# EAGLE schematic MM (EAGLE 9.2.1)
COMPANY: DvidMakesThings; REVISION: 0.0.1; WEB: https://github.com/DvidMakesThings

## Sheet 1 of 9: Microcontroller I.
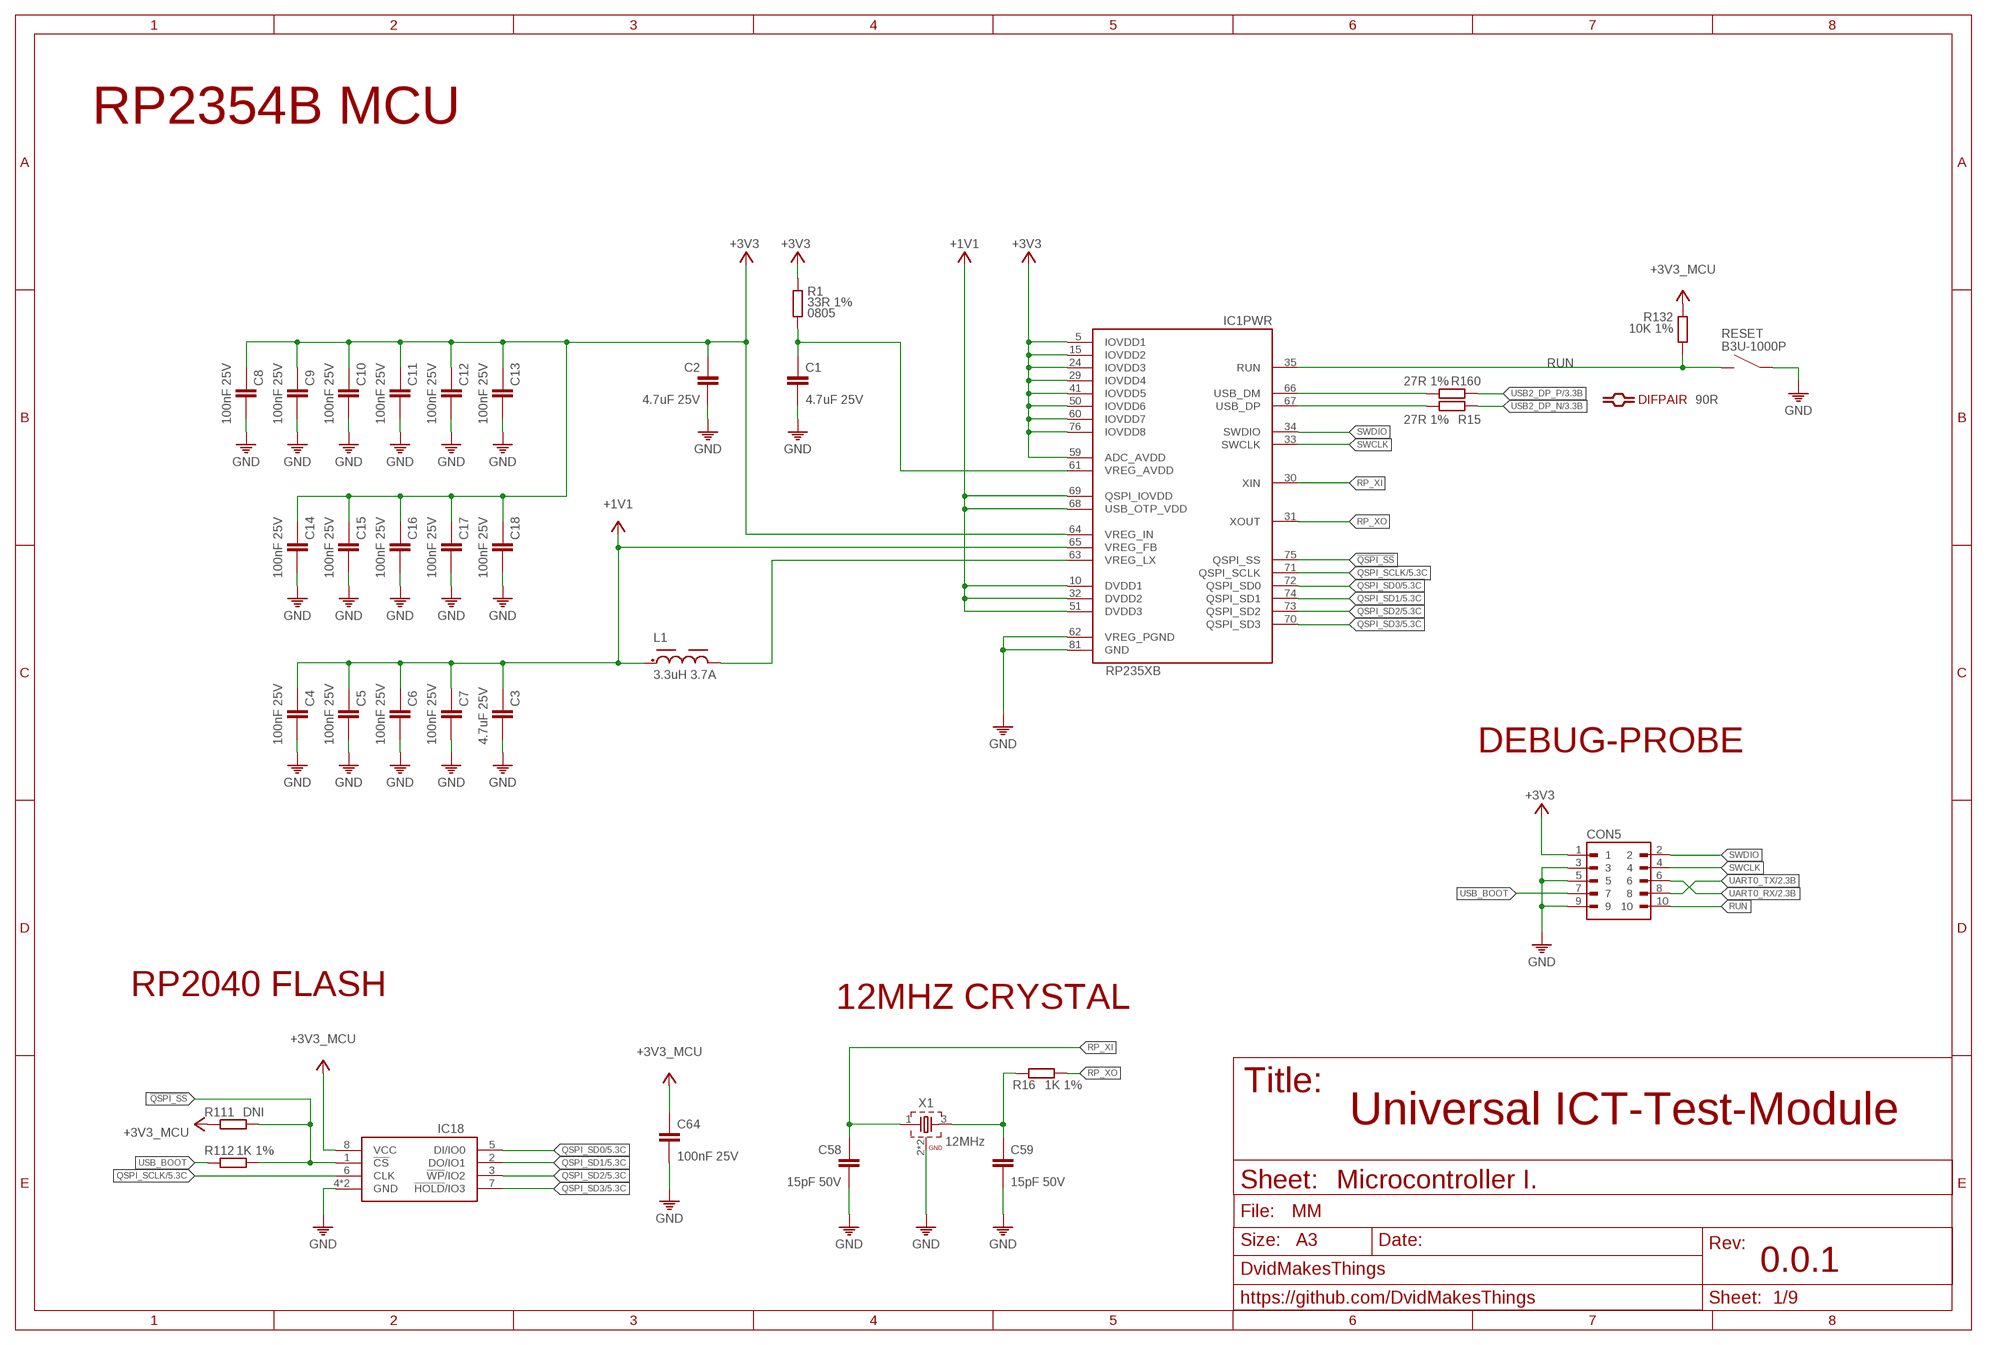
[diagram p0: schematic, sheet 1]

### Parts
C1  4.7uF 25V  4.7UF-25V0402  [0402@1]
C2  4.7uF 25V  4.7UF-25V0402  [0402@1]
C3  4.7uF 25V  4.7UF-25V0402  [0402@1]
C4  100nF 25V  100NF-25V-0201  [0201]
C5  100nF 25V  100NF-25V-0201  [0201]
C6  100nF 25V  100NF-25V-0201  [0201]
C7  100nF 25V  100NF-25V-0201  [0201]
C8  100nF 25V  100NF-25V-0201  [0201]
C9  100nF 25V  100NF-25V-0201  [0201]
C10  100nF 25V  100NF-25V-0201  [0201]
C11  100nF 25V  100NF-25V-0201  [0201]
C12  100nF 25V  100NF-25V-0201  [0201]
C13  100nF 25V  100NF-25V-0201  [0201]
C14  100nF 25V  100NF-25V-0201  [0201]
C15  100nF 25V  100NF-25V-0201  [0201]
C16  100nF 25V  100NF-25V-0201  [0201]
C17  100nF 25V  100NF-25V-0201  [0201]
C18  100nF 25V  100NF-25V-0201  [0201]
C58  15pF 50V  15PF-50V0201  [0201]
C59  15pF 50V  15PF-50V0201  [0201]
C64  100nF 25V  100NF-25V-0201  [0201]
CON5  3220_10_0300_00  [3220_10_0300_00]
IC1  RP235XB  [QFN80-10X10]
IC18  W25Q128JVPIQ  W25Q128JVP  [SON127P600X500X75-8N]
L1  3.3uH 3.7A  3.3UHL-6.6X6.6  [L-6.6X6.6]
R1  33R 1%  33R-1%0805  [0805]
R15  27R 1%  27R-1%0201  [0201]
R16  1K 1%  1K-1%0201  [0201]
R111  DNI  R0201  [R0201]
R112  1K 1%  1K-1%0402  [0402]
R132  10K 1%  10K-1%0402  [0402]
R160  27R 1%  27R-1%0201  [0201]
RESET  B3U-1000P  B3U-1000P  [B3U-1000P]
X1  12MHz  CRYSTAL-3225X322512MSB4SI  [WE-XTAL_CFPX-180]

### Nets
!QSPI_SS: IC1.75(PWR:QSPI_SS) IC18.1(!CS) R111.1 R112.2
+1V1: C3.1 C4.1 C5.1 C6.1 C7.1 IC1.10(PWR:DVDD1) IC1.32(PWR:DVDD2) IC1.51(PWR:DVDD3) IC1.65(PWR:VREG_FB) IC1.68(PWR:USB_OTP_VDD) IC1.69(PWR:QSPI_IOVDD) L1.1
+3V3: C2.1 C8.1 C9.1 C10.1 C11.1 C12.1 C13.1 C14.1 C15.1 C16.1 C17.1 C18.1 CON5.1 IC1.5(PWR:IOVDD1) IC1.15(PWR:IOVDD2) IC1.24(PWR:IOVDD3) IC1.29(PWR:IOVDD4) IC1.41(PWR:IOVDD5) IC1.50(PWR:IOVDD6) IC1.59(PWR:ADC_AVDD) IC1.60(PWR:IOVDD7) IC1.64(PWR:VREG_IN) IC1.76(PWR:IOVDD8) R1.1 ; also sheet 3,4,5,6
+3V3_MCU: C64.1 IC18.8(VCC) R111.2 R132.1
GND: C1.2 C2.2 C3.2 C4.2 C5.2 C6.2 C7.2 C8.2 C9.2 C10.2 C11.2 C12.2 C13.2 C14.2 C15.2 C16.2 C17.2 C18.2 C58.2 C59.2 C64.2 CON5.3 CON5.5 CON5.9 IC1.62(PWR:VREG_PGND) IC1.81(PWR:GND) IC18.4(GND) IC18.PAD(GND) RESET.1 X1.2(GND) X1.4(GND) ; also sheet 3,4,5,6
N$1: C1.1 IC1.61(PWR:VREG_AVDD) R1.2
N$2: IC1.63(PWR:VREG_LX) L1.2
N$53: C59.1 R16.1 X1.3
QSPI_SCLK: IC1.71(PWR:QSPI_SCLK) IC18.6(CLK) ; also sheet 5
QSPI_SD0: IC1.72(PWR:QSPI_SD0) IC18.5(DI/IO0) ; also sheet 5
QSPI_SD1: IC1.74(PWR:QSPI_SD1) IC18.2(DO/IO1) ; also sheet 5
QSPI_SD2: IC1.73(PWR:QSPI_SD2) IC18.3(!WP!/IO2) ; also sheet 5
QSPI_SD3: IC1.70(PWR:QSPI_SD3) IC18.7(!HOLD!/IO3) ; also sheet 5
RP_DP_N [90R_DIFFPAIR]: IC1.67(PWR:USB_DP) R15.2
RP_DP_P [90R_DIFFPAIR]: IC1.66(PWR:USB_DM) R160.2
RP_XI: C58.1 IC1.30(PWR:XIN) X1.1
RP_XO: IC1.31(PWR:XOUT) R16.2
RUN: CON5.10 IC1.35(PWR:RUN) R132.2 RESET.2
SWCLK: CON5.4 IC1.33(PWR:SWCLK)
SWDIO: CON5.2 IC1.34(PWR:SWDIO)
UART0_RX [90R_DIFFPAIR]: CON5.6 ; also sheet 2
UART0_TX [90R_DIFFPAIR]: CON5.8 ; also sheet 2
USB2_DP_N [90R_DIFFPAIR]: R15.1 ; also sheet 3
USB2_DP_P [90R_DIFFPAIR]: R160.1 ; also sheet 3
USB_BOOT: CON5.7 R112.1

### Notes on the sheet
- RP2354B MCU
- DEBUG-PROBE
- RP2040 FLASH
- 12MHZ CRYSTAL
- Universal ICT-Test-Module
- Microcontroller I.

## Sheet 2 of 9: Microcontroller II.
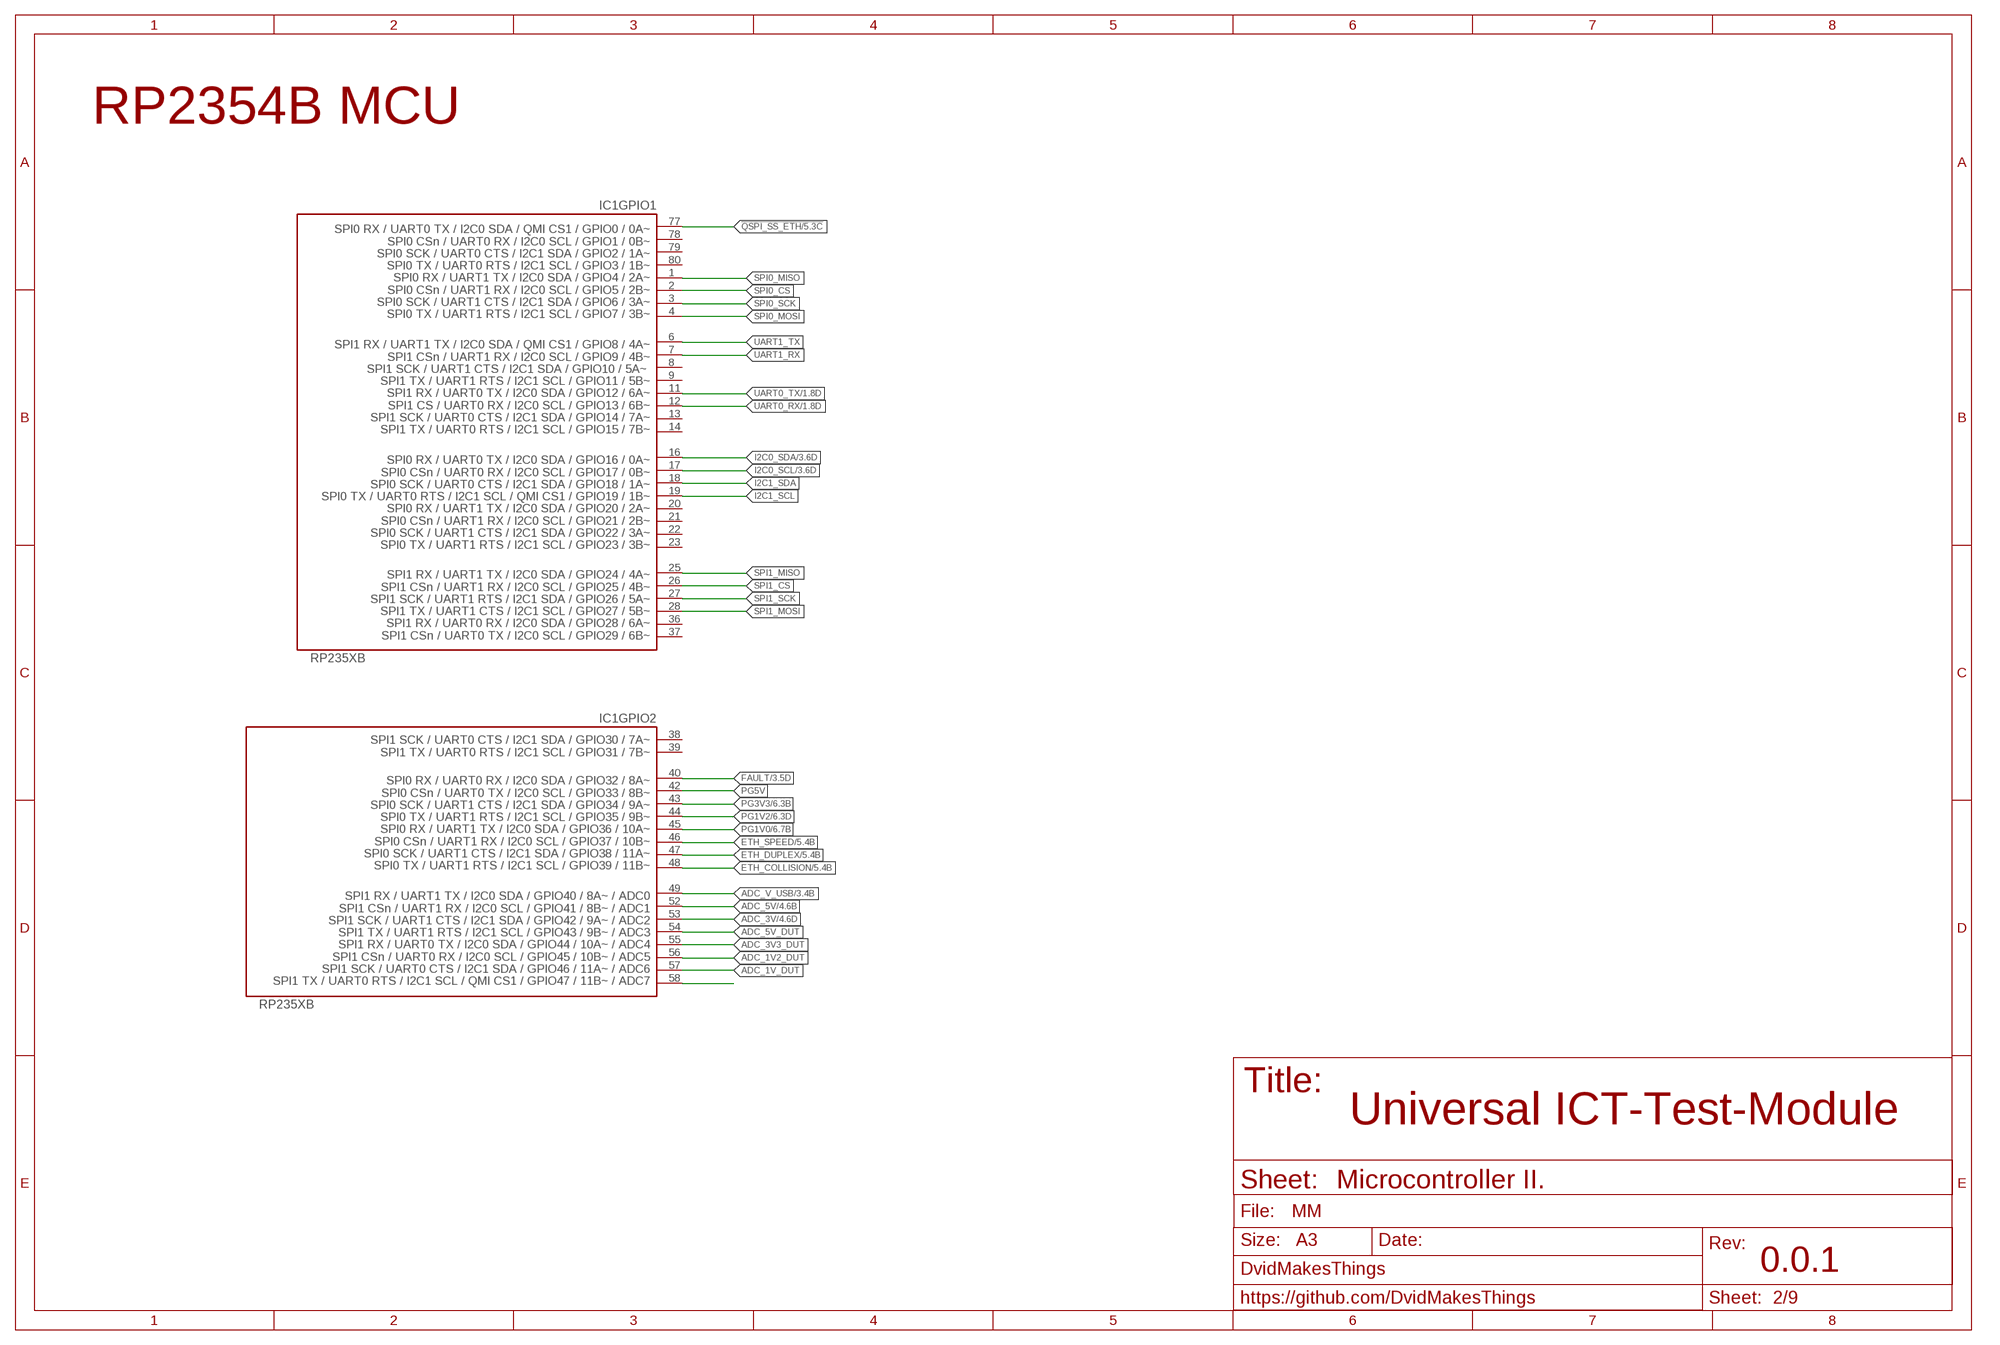
[diagram p1: schematic, sheet 2]

### Nets
!QSPI_SS_ETH: IC1.77(GPIO1:GPIO0) ; also sheet 5
ADC_1V2_DUT: IC1.56(GPIO2:GPIO45_ADC5)
ADC_1V_DUT: IC1.57(GPIO2:GPIO46_ADC6)
ADC_3V: IC1.53(GPIO2:GPIO42_ADC2) ; also sheet 4
ADC_3V3_DUT: IC1.55(GPIO2:GPIO44_ADC4)
ADC_5V: IC1.52(GPIO2:GPIO41_ADC1) ; also sheet 4
ADC_5V_DUT: IC1.54(GPIO2:GPIO43_ADC3)
ADC_V_USB: IC1.49(GPIO2:GPIO40_ADC0) ; also sheet 3
ETH_COLLISION [90R_DIFFPAIR]: IC1.48(GPIO2:GPIO39) ; also sheet 5
ETH_DUPLEX [90R_DIFFPAIR]: IC1.47(GPIO2:GPIO38) ; also sheet 5
ETH_SPEED [90R_DIFFPAIR]: IC1.46(GPIO2:GPIO37) ; also sheet 5
FAULT: IC1.40(GPIO2:GPIO32) ; also sheet 3
I2C0_SCL: IC1.17(GPIO1:GPIO17) ; also sheet 3
I2C0_SDA: IC1.16(GPIO1:GPIO16) ; also sheet 3
I2C1_SCL [90R_DIFFPAIR]: IC1.19(GPIO1:GPIO19)
I2C1_SDA [90R_DIFFPAIR]: IC1.18(GPIO1:GPIO18)
N$27: IC1.58(GPIO2:GPIO47_ADC7)
PG1V0: IC1.45(GPIO2:GPIO36) ; also sheet 6
PG1V2 [90R_DIFFPAIR]: IC1.44(GPIO2:GPIO35) ; also sheet 6
PG3V3: IC1.43(GPIO2:GPIO34) ; also sheet 6
PG5V: IC1.42(GPIO2:GPIO33)
SPI0_CS [90R_DIFFPAIR]: IC1.2(GPIO1:GPIO5)
SPI0_MISO [90R_DIFFPAIR]: IC1.1(GPIO1:GPIO4)
SPI0_MOSI [90R_DIFFPAIR]: IC1.4(GPIO1:GPIO7)
SPI0_SCK [90R_DIFFPAIR]: IC1.3(GPIO1:GPIO6)
SPI1_CS [90R_DIFFPAIR]: IC1.26(GPIO1:GPIO25)
SPI1_MISO [90R_DIFFPAIR]: IC1.25(GPIO1:GPIO24)
SPI1_MOSI [90R_DIFFPAIR]: IC1.28(GPIO1:GPIO27)
SPI1_SCK [90R_DIFFPAIR]: IC1.27(GPIO1:GPIO26)
UART0_RX [90R_DIFFPAIR]: IC1.12(GPIO1:GPIO13) ; also sheet 1
UART0_TX [90R_DIFFPAIR]: IC1.11(GPIO1:GPIO12) ; also sheet 1
UART1_RX [90R_DIFFPAIR]: IC1.7(GPIO1:GPIO9)
UART1_TX [90R_DIFFPAIR]: IC1.6(GPIO1:GPIO8)
Unconnected: IC1.8(GPIO1:GPIO10) IC1.9(GPIO1:GPIO11) IC1.13(GPIO1:GPIO14) IC1.14(GPIO1:GPIO15) IC1.20(GPIO1:GPIO20) IC1.21(GPIO1:GPIO21) IC1.22(GPIO1:GPIO22) IC1.23(GPIO1:GPIO23) IC1.36(GPIO1:GPIO28) IC1.37(GPIO1:GPIO29) IC1.38(GPIO2:GPIO30) IC1.39(GPIO2:GPIO31) IC1.78(GPIO1:GPIO1) IC1.79(GPIO1:GPIO2) IC1.80(GPIO1:GPIO3)

### Notes on the sheet
- RP2354B MCU
- Universal ICT-Test-Module
- Microcontroller II.

## Sheet 3 of 9: Power I. - USB
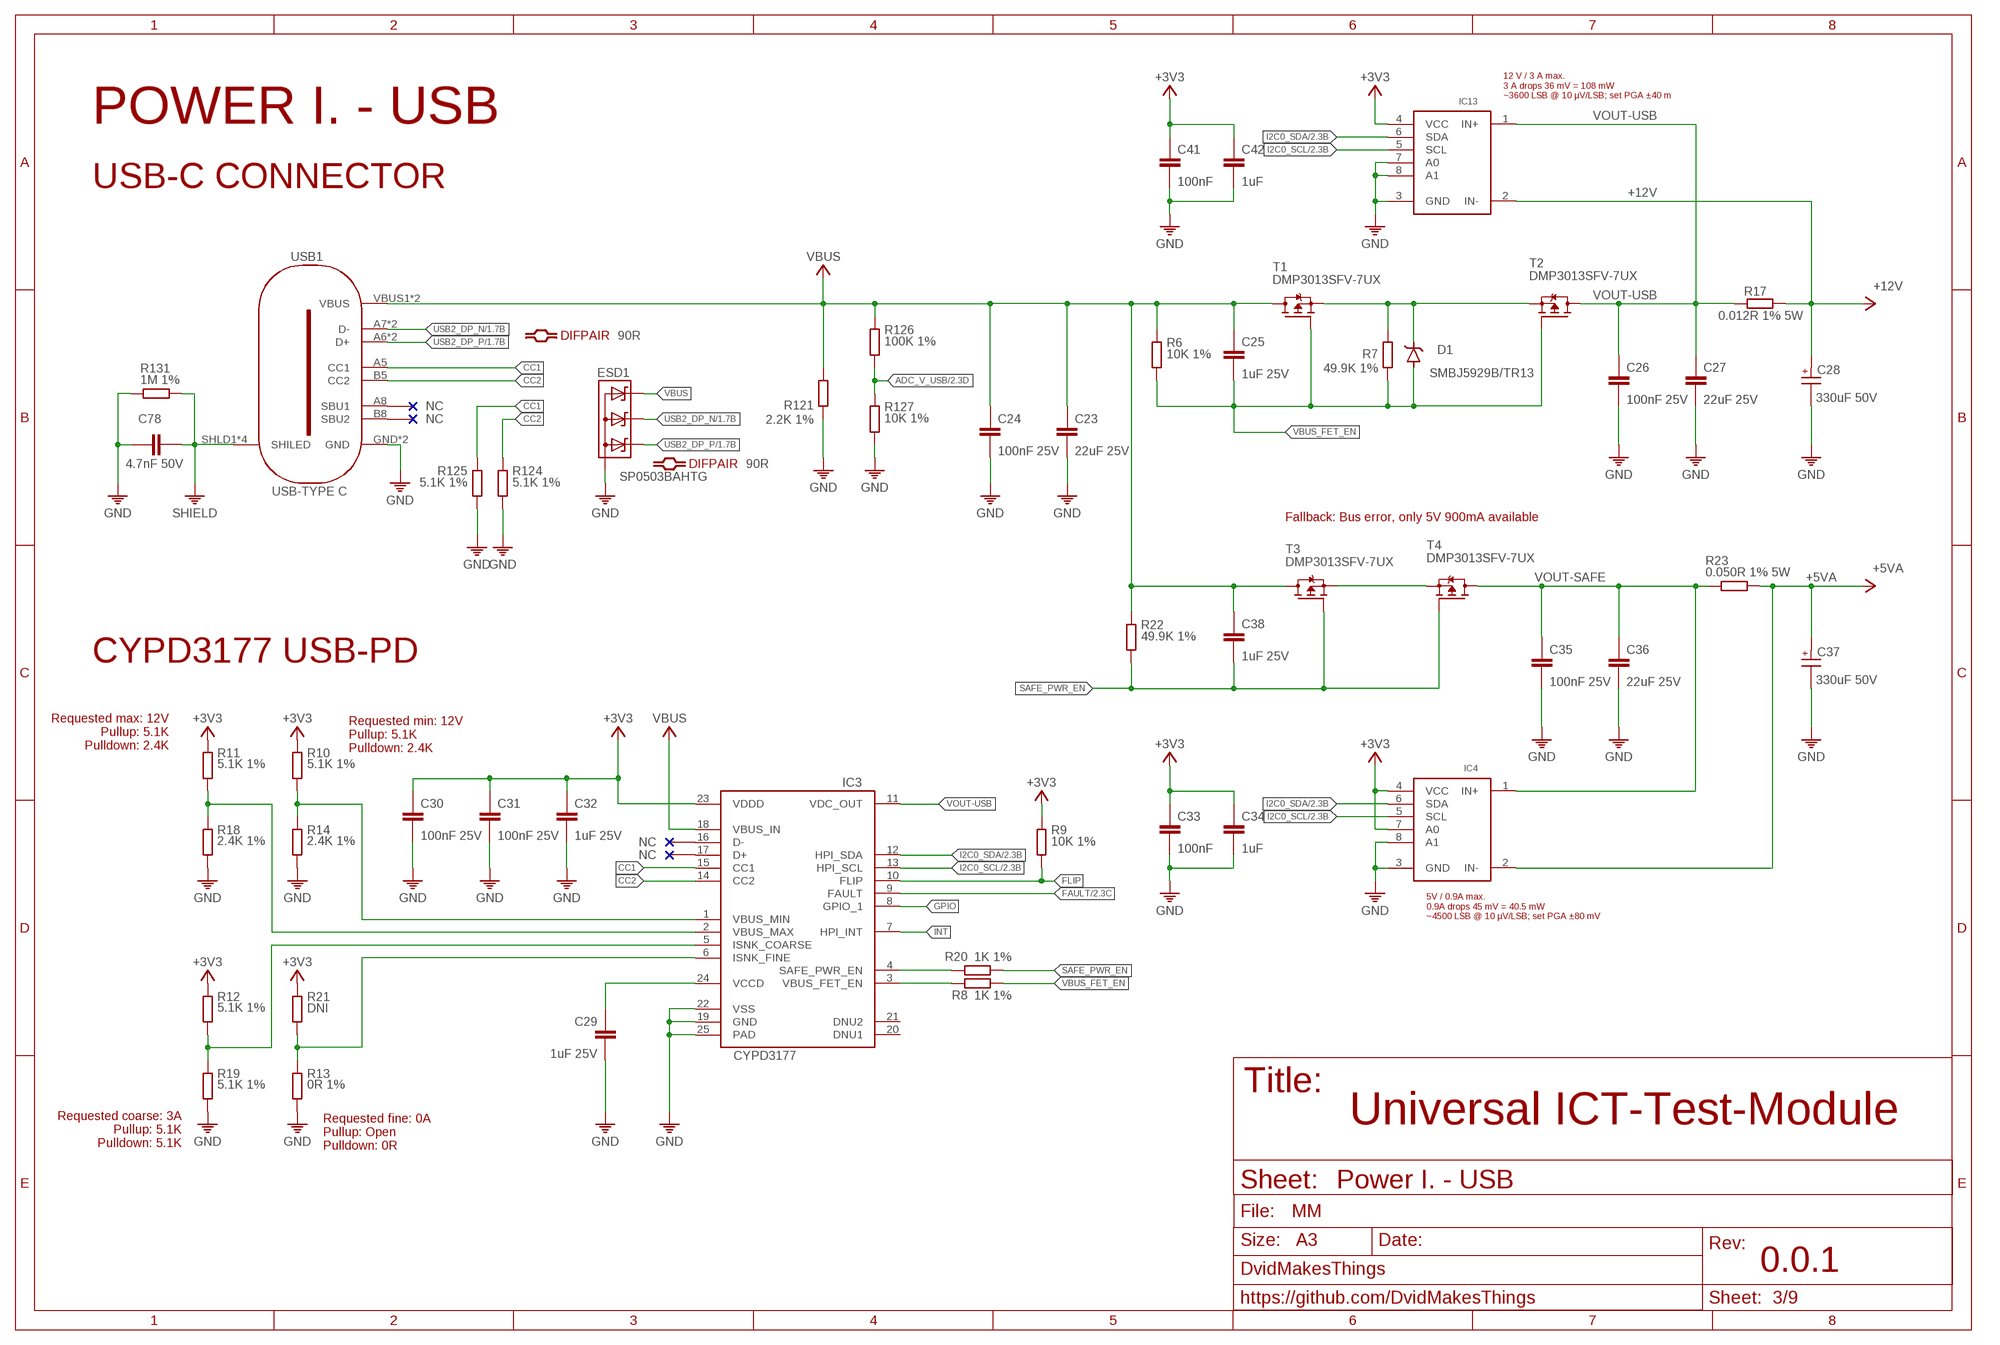
[diagram p2: schematic, sheet 3]

### Parts
C23  22uF 25V  22UF-25V-0805  [0805]
C24  100nF 25V  100NF-25V-0402  [0402]
C25  1uF 25V  1UF-25V0402  [0402@1]
C26  100nF 25V  100NF-25V-0402  [0402]
C27  22uF 25V  22UF-25V-0805  [0805]
C28  330uF 50V  330UF-50V10X10.5(DXL)  [10X10.5(DXL)]
C29  1uF 25V  1UF-25V0402  [0402@1]
C30  100nF 25V  100NF-25V-0402  [0402]
C31  100nF 25V  100NF-25V-0402  [0402]
C32  1uF 25V  1UF-25V0402  [0402@1]
C33  100nF  C-0201  [0201]
C34  1uF  C-0201  [0201]
C35  100nF 25V  100NF-25V-0402  [0402]
C36  22uF 25V  22UF-25V-0805  [0805]
C37  330uF 50V  330UF-50V10X10.5(DXL)  [10X10.5(DXL)]
C38  1uF 25V  1UF-25V0402  [0402@1]
C41  100nF  C-0201  [0201]
C42  1uF  C-0201  [0201]
C78  4.7nF 50V  4.7NF-50V0402  [0402@1]
D1  SMBJ5929B/TR13  SMBJ5929B  [WE-TVSP_DO-214AA_UNIDIRECTIONAL]
ESD1  SP0503BAHTG  SP0503BAHT  [SOT143]
IC3  CYPD3177  CYPD3177-24LQXQT  [QFN24]
IC4  INA219BIDCNT  [SOT23-8]
IC13  INA219BIDCNT  [SOT23-8]
R6  10K 1%  10K-1%0402  [0402]
R7  49.9K 1%  49.9K-1%0805  [0805]
R8  1K 1%  1K-1%0402  [0402]
R9  10K 1%  10K-1%0402  [0402]
R10  5.1K 1%  5.1K-1%0402  [0402]
R11  5.1K 1%  5.1K-1%0402  [0402]
R12  5.1K 1%  5.1K-1%0402  [0402]
R13  0R 1%  0R0402  [0402]
R14  2.4K 1%  2.4K-1%0402  [0402]
R17  0.012R 1% 5W  0.012R-1%  [2512]
R18  2.4K 1%  2.4K-1%0402  [0402]
R19  5.1K 1%  5.1K-1%0402  [0402]
R20  1K 1%  1K-1%0402  [0402]
R21  DNI  R0402  [0402]
R22  49.9K 1%  49.9K-1%0805  [0805]
R23  0.050R 1% 5W  0.050R-1%  [2512]
R121  2.2K 1%  2.2K-1%0201  [0201]
R124  5.1K 1%  5.1K-1%0201  [0201]
R125  5.1K 1%  5.1K-1%0201  [0201]
R126  100K 1%  100K-1%0402  [0402]
R127  10K 1%  10K-1%0201  [0201]
R131  1M 1%  1M-1%0402  [0402]
T1  DMP3013SFV-7UX  [POWERDI3333-8_UX_DIO-L]
T2  DMP3013SFV-7UX  [POWERDI3333-8_UX_DIO-L]
T3  DMP3013SFV-7UX  [POWERDI3333-8_UX_DIO-L]
T4  DMP3013SFV-7UX  [POWERDI3333-8_UX_DIO-L]
USB1  USB-TYPE-C-018  USB_C-THT  [USB-C]

### Nets
+3V3: C30.1 C31.1 C32.1 C33.1 C34.1 C41.1 C42.1 IC3.23(VDDD) IC4.4(VCC) IC4.7(A0) IC13.4(VCC) R9.1 R10.1 R11.1 R12.1 R21.1 ; also sheet 1,4,5,6
+5VA: C37.1(+) IC4.2(IN-) R23.2 ; also sheet 6
+12V: C28.1(+) IC13.2(IN-) R17.2 ; also sheet 4
ADC_V_USB: R126.2 R127.1 ; also sheet 2
CC1: IC3.15(CC1) R125.1 USB1.A5(CC1)
CC2: IC3.14(CC2) R124.1 USB1.B5(CC2)
FAULT: IC3.9(FAULT) ; also sheet 2
FLIP: IC3.10(FLIP) R9.2
GND: C23.2 C24.2 C26.2 C27.2 C28.2(-) C29.2 C30.2 C31.2 C32.2 C33.2 C34.2 C35.2 C36.2 C37.2(-) C41.2 C42.2 C78.2 ESD1.1(A) IC3.19(GND) IC3.22(VSS) IC3.25(PAD) IC4.3(GND) IC4.8(A1) IC13.3(GND) IC13.7(A0) IC13.8(A1) R13.2 R14.2 R18.2 R19.2 R121.2 R124.2 R125.2 R127.2 R131.2 USB1.GND USB1.GND2(GND) ; also sheet 1,4,5,6
GPIO: IC3.8(GPIO_1)
I2C0_SCL: IC3.13(HPI_SCL) IC4.5(SCL) IC13.5(SCL) ; also sheet 2
I2C0_SDA: IC3.12(HPI_SDA) IC4.6(SDA) IC13.6(SDA) ; also sheet 2
INT: IC3.7(HPI_INT)
N$3: D1.1(C) R7.1 T1.1(S) T1.2(S) T1.3(S) T2.1(S) T2.2(S) T2.3(S)
N$4: C29.1 IC3.24(VCCD)
N$8: IC3.3(VBUS_FET_EN) R8.2
N$9: IC3.1(VBUS_MIN) R10.2 R14.1
N$10: IC3.2(VBUS_MAX) R11.2 R18.1
N$11: IC3.6(ISNK_FINE) R13.1 R21.2
N$12: IC3.5(ISNK_COARSE) R12.2 R19.1
N$13: IC3.4(SAFE_PWR_EN) R20.2
N$14: T3.1(S) T3.2(S) T3.3(S) T4.1(S) T4.2(S) T4.3(S)
SAFE_PWR_EN: C38.2 R20.1 R22.2 T3.4(G) T4.4(G)
SHIELD: C78.1 R131.1 USB1.SHLD1(SHILED) USB1.SHLD2(SHILED) USB1.SHLD3(SHILED) USB1.SHLD4(SHILED)
USB2_DP_N [90R_DIFFPAIR]: ESD1.3(C2) USB1.A7(D-) USB1.B7(D-) ; also sheet 1
USB2_DP_P [90R_DIFFPAIR]: ESD1.2(C1) USB1.A6(D+) USB1.B6(D+) ; also sheet 1
VBUS: C23.1 C24.1 C25.1 C38.1 ESD1.4(C3) IC3.18(VBUS_IN) R6.1 R22.1 R121.1 R126.1 T1.5(D) T1.6(D) T1.7(D) T1.8(D) T1.9(D) T3.5(D) T3.6(D) T3.7(D) T3.8(D) T3.9(D) USB1.VBUS1(VBUS) USB1.VBUS2(VBUS)
VBUS_FET_EN: C25.2 D1.2(A) R6.2 R7.2 R8.1 T1.4(G) T2.4(G)
VOUT-SAFE: C35.1 C36.1 IC4.1(IN+) R23.1 T4.5(D) T4.6(D) T4.7(D) T4.8(D) T4.9(D)
VOUT-USB: C26.1 C27.1 IC3.11(VDC_OUT) IC13.1(IN+) R17.1 T2.5(D) T2.6(D) T2.7(D) T2.8(D) T2.9(D)
Unconnected: IC3.16(D-) IC3.17(D+) IC3.20(DNU1) IC3.21(DNU2) USB1.A8(SBU1) USB1.B8(SBU2)

### Notes on the sheet
- 12 V / 3 A max.
  3 A drops 36 mV = 108 mW
  ~3600 LSB @ 10 µV/LSB; set PGA ±40 m
- POWER I. - USB
- USB-C CONNECTOR
- Fallback: Bus error, only 5V 900mA available
- CYPD3177 USB-PD
- Requested max: 12V
  Pullup: 5.1K
  Pulldown: 2.4K
- Requested min: 12V
  Pullup: 5.1K
  Pulldown: 2.4K
- 5V / 0.9A max.
  0.9A drops 45 mV = 40.5 mW
  ~4500 LSB @ 10 µV/LSB; set PGA ±80 mV
- Requested coarse: 3A
  Pullup: 5.1K
  Pulldown: 5.1K
- Universal ICT-Test-Module
- Requested fine: 0A
  Pullup: Open
  Pulldown: 0R
- Power I. - USB

## Sheet 4 of 9: Power II. - LDO
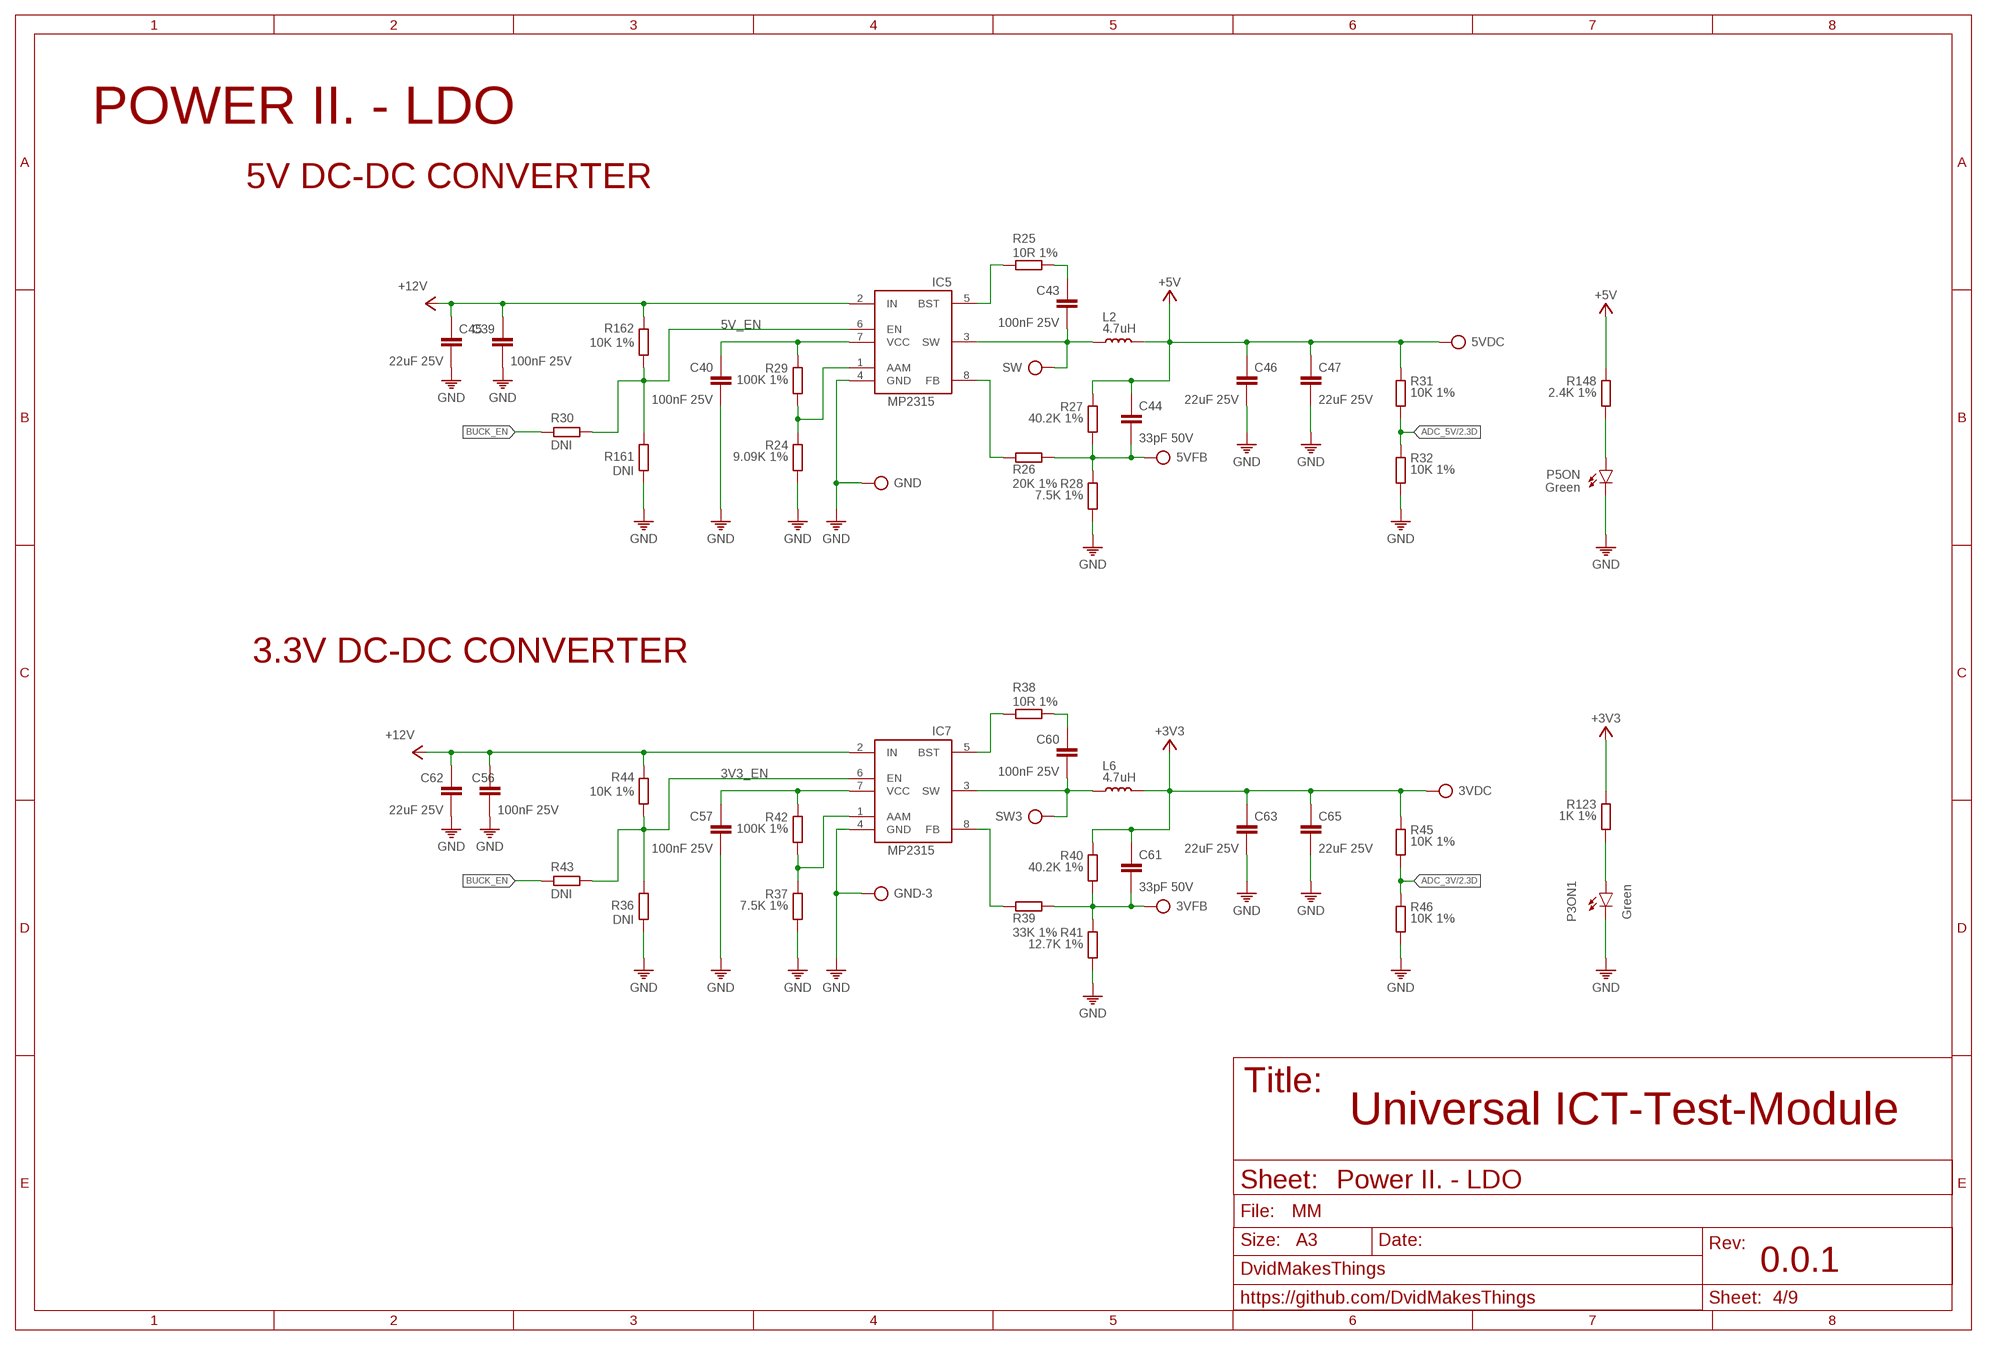
[diagram p3: schematic, sheet 4]

### Parts
3VDC  DNI  TP-ROUND  [TP-ROUND]
3VFB  DNI  TP-ROUND  [TP-ROUND]
5VDC  DNI  TP-ROUND  [TP-ROUND]
5VFB  DNI  TP-ROUND  [TP-ROUND]
C39  100nF 25V  100NF-25V-0402  [0402]
C40  100nF 25V  100NF-25V-0402  [0402]
C43  100nF 25V  100NF-25V-0402  [0402]
C44  33pF 50V  33PF-50V0402  [0402]
C45  22uF 25V  22UF-25V-1206  [1206]
C46  22uF 25V  22UF-25V-1206  [1206]
C47  22uF 25V  22UF-25V-1206  [1206]
C56  100nF 25V  100NF-25V-0402  [0402]
C57  100nF 25V  100NF-25V-0402  [0402]
C60  100nF 25V  100NF-25V-0402  [0402]
C61  33pF 50V  33PF-50V0402  [0402]
C62  22uF 25V  22UF-25V-1206  [1206]
C63  22uF 25V  22UF-25V-1206  [1206]
C65  22uF 25V  22UF-25V-1206  [1206]
GND  DNI  TP-ROUND  [TP-ROUND]
GND-3  DNI  TP-ROUND  [TP-ROUND]
IC5  MP2315GJ-Z  MP2315TSOT23-8  [SOT65P280X110-8N]
IC7  MP2315GJ-Z  MP2315TSOT23-8  [SOT65P280X110-8N]
L2  4.7uH  4.7UH  [SRR5228A]
L6  4.7uH  4.7UH  [SRR5228A]
P3ON1  Green  LED-GREENLED-0603  [LED-0603]
P5ON  Green  LED-GREENLED-0603  [LED-0603]
R24  9.09K 1%  9.09K-1%0402  [0402]
R25  10R 1%  10R-1%0402  [0402]
R26  20K 1%  20K-1%0402  [0402]
R27  40.2K 1%  40.2K-1%0402  [0402]
R28  7.5K 1%  7.5K-1%0402  [0402]
R29  100K 1%  100K-1%0402  [0402]
R30  DNI  R0402  [0402]
R31  10K 1%  10K-1%0201  [0201]
R32  10K 1%  10K-1%0201  [0201]
R36  DNI  R0402  [0402]
R37  7.5K 1%  7.5K-1%0402  [0402]
R38  10R 1%  10R-1%0402  [0402]
R39  33K 1%  33K-1%0402  [0402]
R40  40.2K 1%  40.2K-1%0402  [0402]
R41  12.7K 1%  12.7K-1%0402  [0402]
R42  100K 1%  100K-1%0402  [0402]
R43  DNI  R0402  [0402]
R44  10K 1%  10K-1%0402  [0402]
R45  10K 1%  10K-1%0201  [0201]
R46  10K 1%  10K-1%0201  [0201]
R123  1K 1%  1K-1%0402  [0402]
R148  2.4K 1%  2.4K-1%0402  [0402]
R161  DNI  R0402  [0402]
R162  10K 1%  10K-1%0402  [0402]
SW  DNI  TP-ROUND  [TP-ROUND]
SW3  DNI  TP-ROUND  [TP-ROUND]

### Nets
3V3_EN: IC7.6(EN) R36.2 R43.1 R44.1 ; also sheet 6
3VFB: 3VFB.TP C61.2 R39.2 R40.2 R41.1
5V_EN: IC5.6(EN) R30.1 R161.2 R162.1
5VFB: 5VFB.TP C44.2 R26.2 R27.2 R28.1
+3V3: 3VDC.TP C61.1 C63.1 C65.1 L6.2 R40.1 R45.1 R123.1 ; also sheet 1,3,5,6
+5V: 5VDC.TP C44.1 C46.1 C47.1 L2.2 R27.1 R31.1 R148.1 ; also sheet 6
+12V: C39.1 C45.1 C56.1 C62.1 IC5.2(IN) IC7.2(IN) R44.2 R162.2 ; also sheet 3
ADC_3V: R45.2 R46.1 ; also sheet 2
ADC_5V: R31.2 R32.1 ; also sheet 2
BUCK_EN: R30.2 R43.2
GND: C39.2 C40.2 C45.2 C46.2 C47.2 C56.2 C57.2 C62.2 C63.2 C65.2 GND-3.TP GND.TP IC5.4(GND) IC7.4(GND) P3ON1.C P5ON.C R24.2 R28.2 R32.2 R36.1 R37.2 R41.2 R46.2 R161.1 ; also sheet 1,3,5,6
N$15: IC5.5(BST) R25.2
N$16: IC5.8(FB) R26.1
N$17: P5ON.A R148.2
N$18: C43.1 R25.1
N$20: P3ON1.A R123.2
N$21: C40.1 IC5.7(VCC) R29.1
N$38: IC7.5(BST) R38.2
N$39: IC7.8(FB) R39.1
N$41: C60.1 R38.1
N$44: C57.1 IC7.7(VCC) R42.1
N$45: IC5.1(AAM) R24.1 R29.2
N$46: IC7.1(AAM) R37.1 R42.2
SW3: C60.2 IC7.3(SW) L6.1 SW3.TP
SW5: C43.2 IC5.3(SW) L2.1 SW.TP

### Notes on the sheet
- POWER II. - LDO
- 5V DC-DC CONVERTER
- 3.3V DC-DC CONVERTER
- Universal ICT-Test-Module
- Power II. - LDO

## Sheet 5 of 9: Ethernet
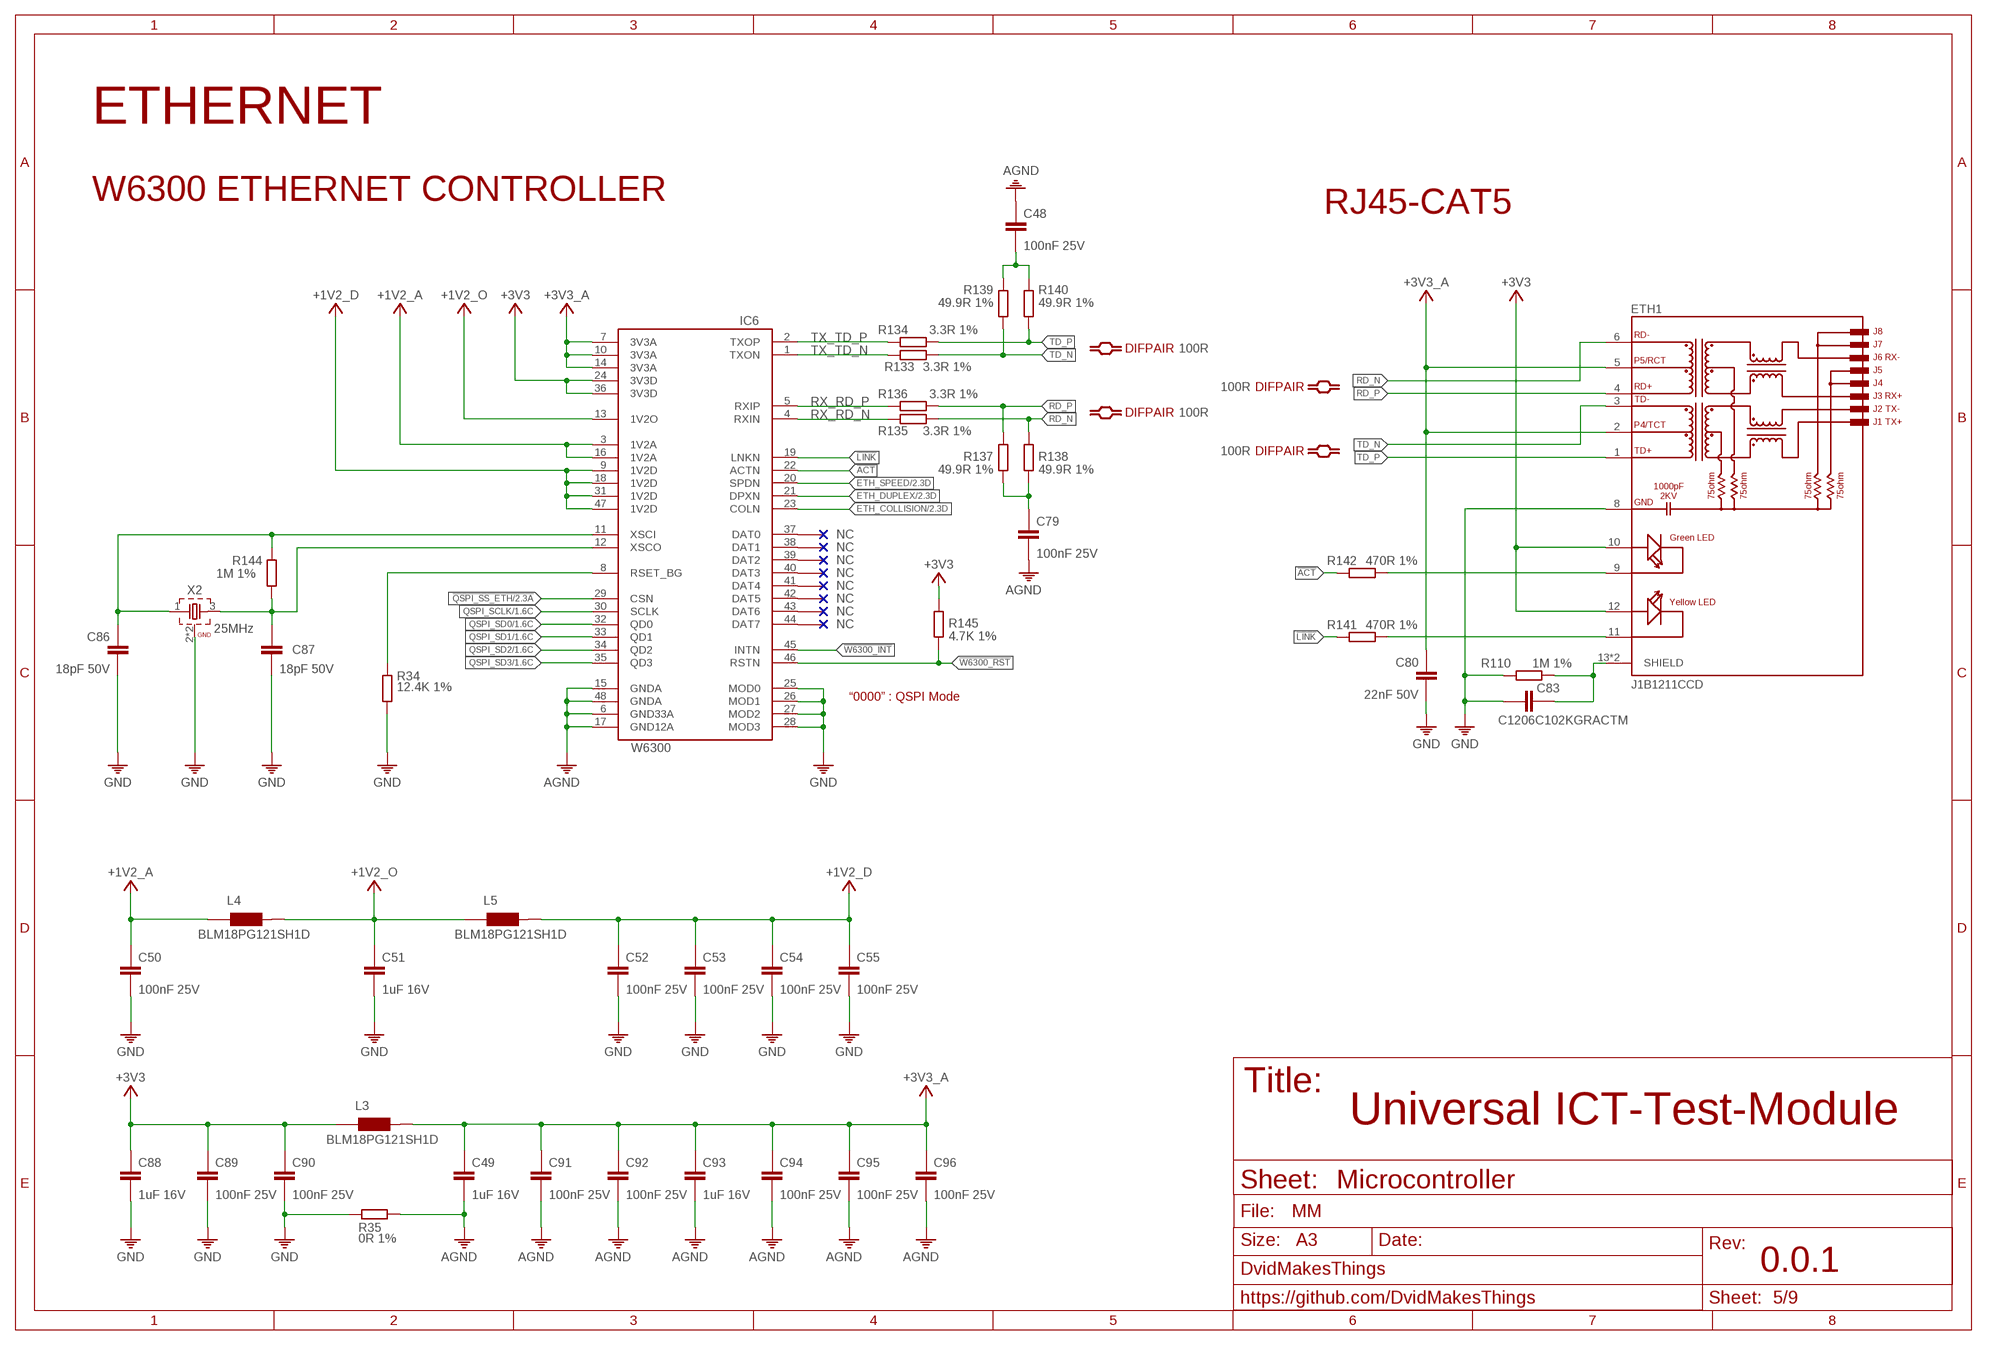
[diagram p4: schematic, sheet 5]

### Parts
C48  100nF 25V  100NF-25V-0402  [0402]
C49  1uF 16V  1UF-16V0201  [0201]
C50  100nF 25V  100NF-25V-0201  [0201]
C51  1uF 16V  1UF-16V0201  [0201]
C52  100nF 25V  100NF-25V-0201  [0201]
C53  100nF 25V  100NF-25V-0201  [0201]
C54  100nF 25V  100NF-25V-0201  [0201]
C55  100nF 25V  100NF-25V-0201  [0201]
C79  100nF 25V  100NF-25V-0402  [0402]
C80  22nF 50V  22NF-50V0402  [0402@1]
C83  C1206C102KGRACTM  1NF-2KV  [1206]
C86  18pF 50V  18PF-50V-0201  [0201]
C87  18pF 50V  18PF-50V-0201  [0201]
C88  1uF 16V  1UF-16V0201  [0201]
C89  100nF 25V  100NF-25V-0201  [0201]
C90  100nF 25V  100NF-25V-0201  [0201]
C91  100nF 25V  100NF-25V-0201  [0201]
C92  100nF 25V  100NF-25V-0201  [0201]
C93  1uF 16V  1UF-16V0201  [0201]
C94  100nF 25V  100NF-25V-0201  [0201]
C95  100nF 25V  100NF-25V-0201  [0201]
C96  100nF 25V  100NF-25V-0201  [0201]
ETH1  J1B1211CCD  [J1B1211CCD]
IC6  W6300  [LQFP48]
L3  BLM18PG121SH1D  [0603]
L4  BLM18PG121SH1D  [0603]
L5  BLM18PG121SH1D  [0603]
R34  12.4K 1%  12.4K-1%0402  [0402]
R35  0R 1%  0R0402  [0402]
R110  1M 1%  1M-1%1206  [1206]
R133  3.3R 1%  3.3R-1%0201  [0201]
R134  3.3R 1%  3.3R-1%0201  [0201]
R135  3.3R 1%  3.3R-1%0201  [0201]
R136  3.3R 1%  3.3R-1%0201  [0201]
R137  49.9R 1%  49.9R-1%0201  [0201]
R138  49.9R 1%  49.9R-1%0201  [0201]
R139  49.9R 1%  49.9R-1%0201  [0201]
R140  49.9R 1%  49.9R-1%0201  [0201]
R141  470R 1%  470R-1%0402  [0402]
R142  470R 1%  470R-1%0402  [0402]
R144  1M 1%  1M-1%0201  [0201]
R145  4.7K 1%  4.7K-1%0201  [0201]
X2  25MHz  CRYSTAL-3225X322525MOB4SI  [WE-XTAL_CFPX-180]

### Nets
!ACT: IC6.22(ACTN) R142.1
!LINK: IC6.19(LNKN) R141.1
!QSPI_SS_ETH: IC6.29(CSN) ; also sheet 2
!W6300_INT: IC6.45(INTN)
!W6300_RST: IC6.46(RSTN) R145.1
+1V2_A: C50.1 IC6.3(1V2A) IC6.16(1V2A) L4.1
+1V2_D: C52.1 C53.1 C54.1 C55.1 IC6.9(1V2D) IC6.18(1V2D) IC6.31(1V2D) IC6.47(1V2D) L5.2
+1V2_O: C51.1 IC6.13(1V2O) L4.2 L5.1
+3V3: C88.1 C89.1 C90.1 ETH1.10(GREEN+) ETH1.12(YELLOW+) IC6.24(3V3D) IC6.36(3V3D) L3.1 R145.2 ; also sheet 1,3,4,6
+3V3A: C49.1 C80.1 C91.1 C92.1 C93.1 C94.1 C95.1 C96.1 ETH1.2(P4/TCT) ETH1.5(P5/RCT) IC6.7(3V3A) IC6.10(3V3A) IC6.14(3V3A) L3.2 ; supply symbol labelled +3V3_A
AGND: C48.1 C49.2 C79.2 C91.2 C92.2 C93.2 C94.2 C95.2 C96.2 IC6.6(GND33A) IC6.15(GNDA) IC6.17(GND12A) IC6.48(GNDA) R35.1
ETH_COLLISION [90R_DIFFPAIR]: IC6.23(COLN) ; also sheet 2
ETH_DUPLEX [90R_DIFFPAIR]: IC6.21(DPXN) ; also sheet 2
ETH_SPEED [90R_DIFFPAIR]: IC6.20(SPDN) ; also sheet 2
GND: C50.2 C51.2 C52.2 C53.2 C54.2 C55.2 C80.2 C83.1 C86.2 C87.2 C88.2 C89.2 C90.2 ETH1.8(GND) IC6.25(MOD0) IC6.26(MOD1) IC6.27(MOD2) IC6.28(MOD3) R34.2 R35.2 R110.1 X2.2(GND) X2.4(GND) ; also sheet 1,3,4,6
N$35: IC6.8(RSET_BG) R34.1
N$82: ETH1.11(YELLOW-) R141.2
N$91: ETH1.9(GREEN-) R142.2
N$101: C87.1 IC6.12(XSCO) R144.1 X2.3
QSPI_SCLK: IC6.30(SCLK) ; also sheet 1
QSPI_SD0: IC6.32(QD0) ; also sheet 1
QSPI_SD1: IC6.33(QD1) ; also sheet 1
QSPI_SD2: IC6.34(QD2) ; also sheet 1
QSPI_SD3: IC6.35(QD3) ; also sheet 1
RD_N [100R_DIFFPAIR]: ETH1.6(RD-) R135.2 R138.2
RD_P [100R_DIFFPAIR]: ETH1.4(RD+) R136.2 R137.2
RX_CM: C79.1 R137.1 R138.1
RX_RD_N [100R_DIFFPAIR]: IC6.4(RXIN) R135.1
RX_RD_P [100R_DIFFPAIR]: IC6.5(RXIP) R136.1
SH1: C83.2 ETH1.13(SHIELD) ETH1.14(SHIELD) R110.2
TD_N [100R_DIFFPAIR]: ETH1.3(TD-) R133.2 R139.1
TD_P [100R_DIFFPAIR]: ETH1.1(TD+) R134.2 R140.1
TX_CM: C48.2 R139.2 R140.2
TX_TD_N [100R_DIFFPAIR]: IC6.1(TXON) R133.1
TX_TD_P [100R_DIFFPAIR]: IC6.2(TXOP) R134.1
XO: C86.1 IC6.11(XSCI) R144.2 X2.1
Unconnected: IC6.37(DAT0) IC6.38(DAT1) IC6.39(DAT2) IC6.40(DAT3) IC6.41(DAT4) IC6.42(DAT5) IC6.43(DAT6) IC6.44(DAT7)

### Notes on the sheet
- ETHERNET
- W6300 ETHERNET CONTROLLER
- RJ45-CAT5
- “0000” : QSPI Mode
- Universal ICT-Test-Module
- Microcontroller

## Sheet 6 of 9: DUT-Power
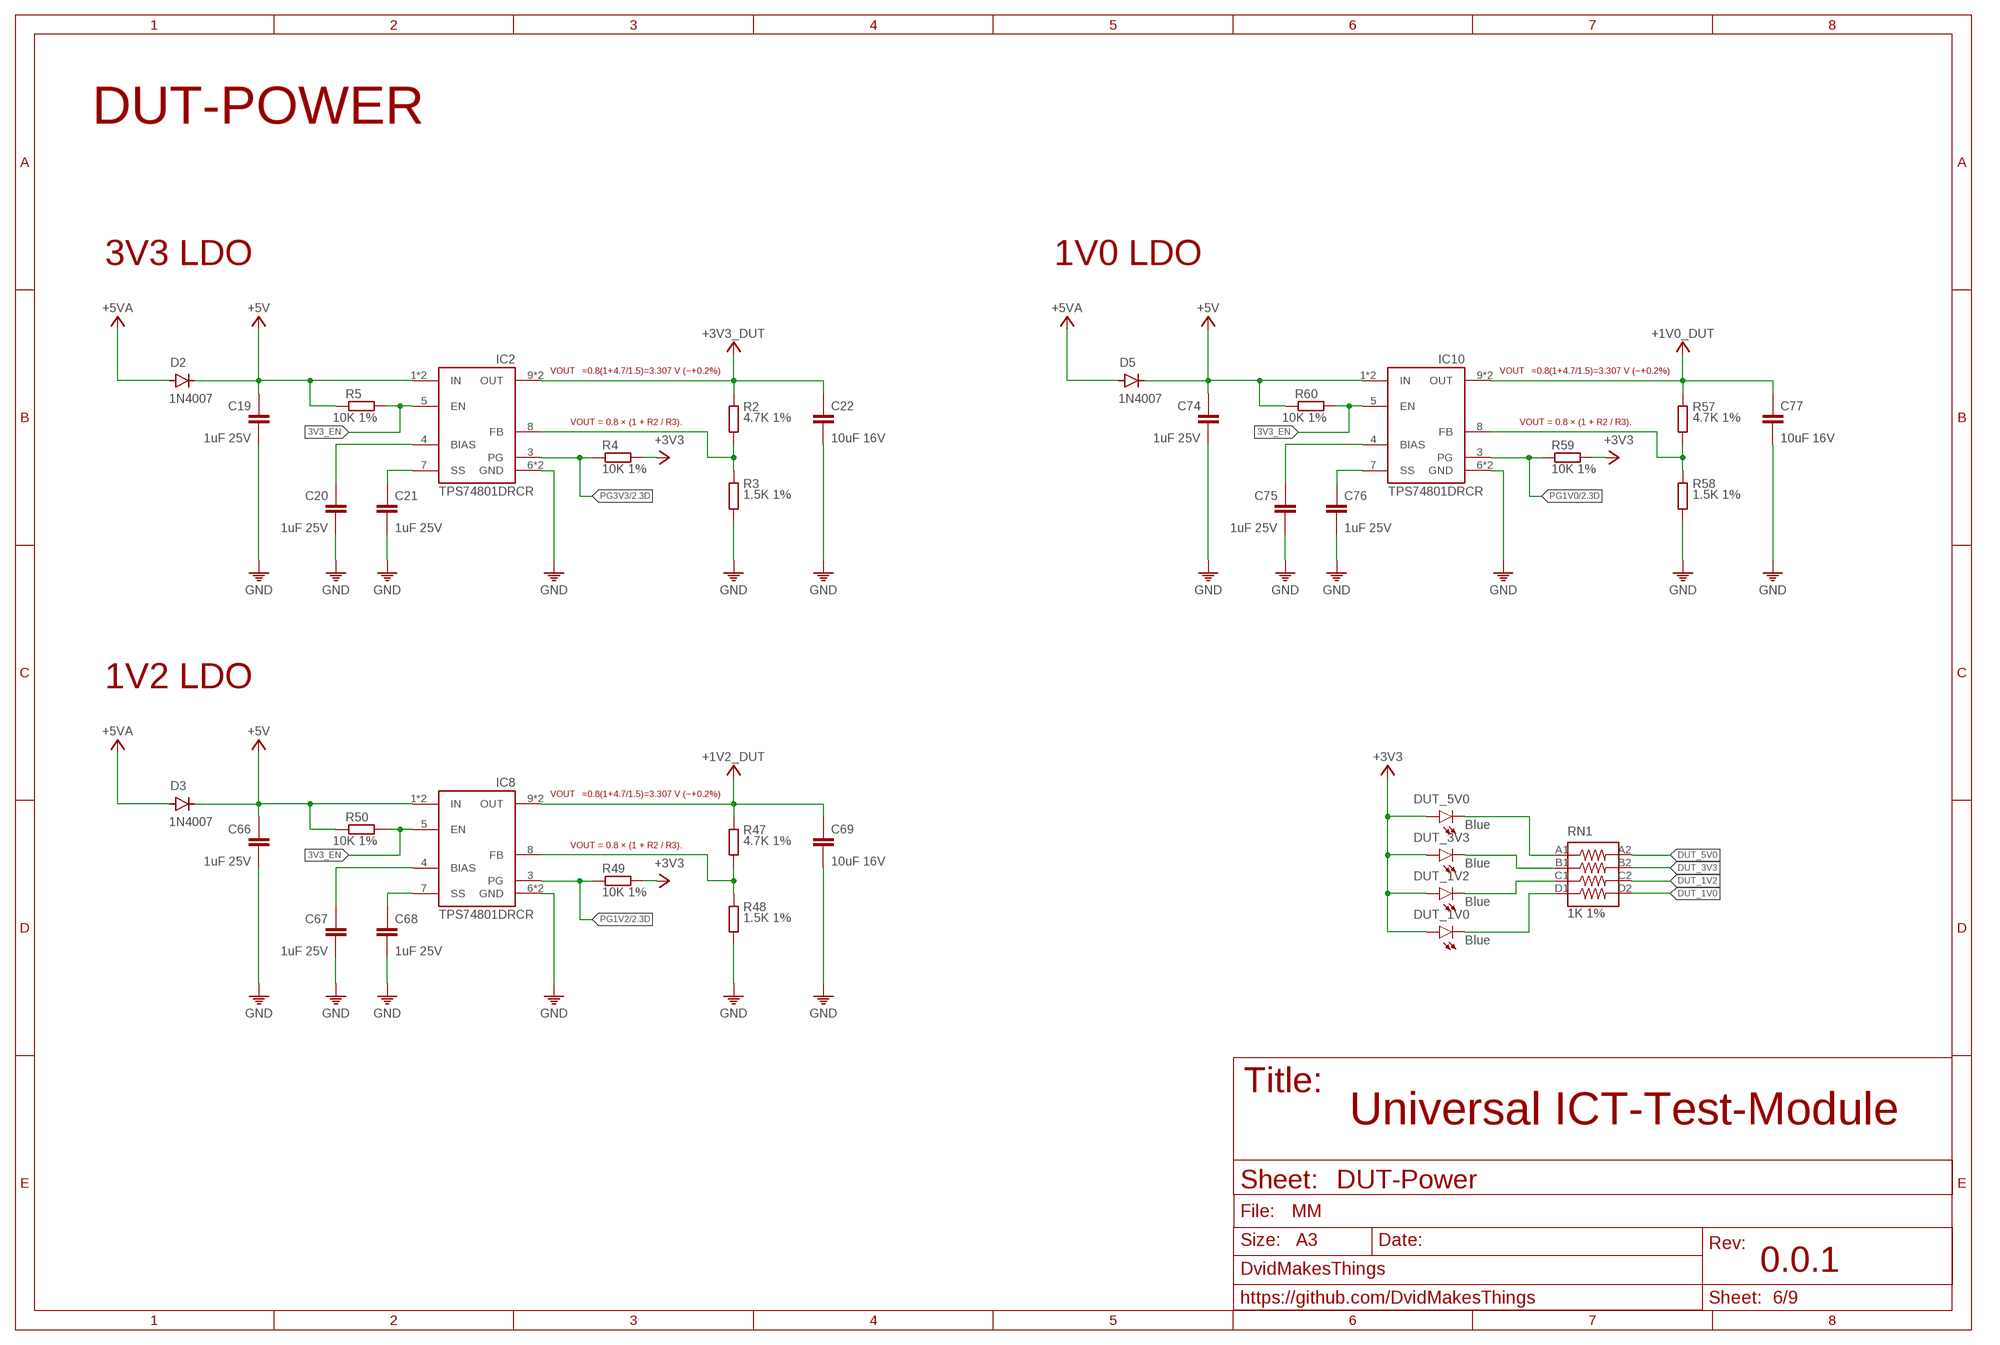
[diagram p5: schematic, sheet 6]

### Parts
C19  1uF 25V  1UF-25V0402  [0402@1]
C20  1uF 25V  1UF-25V0402  [0402@1]
C21  1uF 25V  1UF-25V0402  [0402@1]
C22  10uF 16V  10UF-16V-0603  [0603]
C66  1uF 25V  1UF-25V0402  [0402@1]
C67  1uF 25V  1UF-25V0402  [0402@1]
C68  1uF 25V  1UF-25V0402  [0402@1]
C69  10uF 16V  10UF-16V-0603  [0603]
C74  1uF 25V  1UF-25V0402  [0402@1]
C75  1uF 25V  1UF-25V0402  [0402@1]
C76  1uF 25V  1UF-25V0402  [0402@1]
C77  10uF 16V  10UF-16V-0603  [0603]
D2  1N4007  [SMA/DO-214AC]
D3  1N4007  [SMA/DO-214AC]
D5  1N4007  [SMA/DO-214AC]
DUT_1V0  Blue  LED-BLUELED-0603  [LED-0603]
DUT_1V2  Blue  LED-BLUELED-0603  [LED-0603]
DUT_3V3  Blue  LED-BLUELED-0603  [LED-0603]
DUT_5V0  Blue  LED-BLUELED-0603  [LED-0603]
IC2  TPS74801DRCR  TPS74801DRC  [VSON10-3X3]
IC8  TPS74801DRCR  TPS74801DRC  [VSON10-3X3]
IC10  TPS74801DRCR  TPS74801DRC  [VSON10-3X3]
R2  4.7K 1%  4.7K-1%0402  [0402]
R3  1.5K 1%  1.5K-1%0402  [0402]
R4  10K 1%  10K-1%0402  [0402]
R5  10K 1%  10K-1%0402  [0402]
R47  4.7K 1%  4.7K-1%0402  [0402]
R48  1.5K 1%  1.5K-1%0402  [0402]
R49  10K 1%  10K-1%0402  [0402]
R50  10K 1%  10K-1%0402  [0402]
R57  4.7K 1%  4.7K-1%0402  [0402]
R58  1.5K 1%  1.5K-1%0402  [0402]
R59  10K 1%  10K-1%0402  [0402]
R60  10K 1%  10K-1%0402  [0402]
RN1  1K 1%  1K-1%_ARRAY0603X4-1206  [_0603X4-1206]

### Nets
3V3_EN: IC2.5(EN) IC8.5(EN) IC10.5(EN) R5.2 R50.2 R60.2 ; also sheet 4
+1V0_DUT: C77.1 IC10.9(OUT) IC10.10(OUT) R57.1
+1V2_DUT: C69.1 IC8.9(OUT) IC8.10(OUT) R47.1
+3V3: DUT_1V0.A DUT_1V2.A DUT_3V3.A DUT_5V0.A R4.1 R49.1 R59.1 ; also sheet 1,3,4,5
+3V3_DUT: C22.1 IC2.9(OUT) IC2.10(OUT) R2.1
+5V: C19.1 C66.1 C74.1 D2.C D3.C D5.C IC2.1(IN) IC2.2(IN) IC8.1(IN) IC8.2(IN) IC10.1(IN) IC10.2(IN) R5.1 R50.1 R60.1 ; also sheet 4
+5VA: D2.A D3.A D5.A ; also sheet 3
DUT_1V0 [90R_DIFFPAIR]: RN1.D2
DUT_1V2 [90R_DIFFPAIR]: RN1.C2
DUT_3V3 [90R_DIFFPAIR]: RN1.B2
DUT_5V0 [90R_DIFFPAIR]: RN1.A2
GND: C19.2 C20.2 C21.2 C22.2 C66.2 C67.2 C68.2 C69.2 C74.2 C75.2 C76.2 C77.2 IC2.6(GND) IC2.PAD(GND) IC8.6(GND) IC8.PAD(GND) IC10.6(GND) IC10.PAD(GND) R3.2 R48.2 R58.2 ; also sheet 1,3,4,5
N$5: C20.1 IC2.4(BIAS)
N$6: C21.1 IC2.7(SS)
N$7: IC2.8(FB) R2.2 R3.1
N$19 [90R_DIFFPAIR]: DUT_5V0.C RN1.A1
N$22: C67.1 IC8.4(BIAS)
N$23: C68.1 IC8.7(SS)
N$24: IC8.8(FB) R47.2 R48.1
N$25 [90R_DIFFPAIR]: DUT_3V3.C RN1.B1
N$30 [90R_DIFFPAIR]: DUT_1V2.C RN1.C1
N$31: C75.1 IC10.4(BIAS)
N$32: C76.1 IC10.7(SS)
N$33: IC10.8(FB) R57.2 R58.1
N$34 [90R_DIFFPAIR]: DUT_1V0.C RN1.D1
PG1V0: IC10.3(PG) R59.2 ; also sheet 2
PG1V2 [90R_DIFFPAIR]: IC8.3(PG) R49.2 ; also sheet 2
PG3V3: IC2.3(PG) R4.2 ; also sheet 2

### Notes on the sheet
- DUT-POWER
- 3V3 LDO | 1V0 LDO
- VOUT​≈0.8(1+4.7/1.5)=3.307 V (~+0.2%) | VOUT​≈0.8(1+4.7/1.5)=3.307 V (~+0.2%)
- VOUT = 0.8 × (1 + R2 / R3). | VOUT = 0.8 × (1 + R2 / R3).
- 1V2 LDO
- VOUT​≈0.8(1+4.7/1.5)=3.307 V (~+0.2%)
- VOUT = 0.8 × (1 + R2 / R3).
- Universal ICT-Test-Module
- DUT-Power

## Sheet 7 of 9
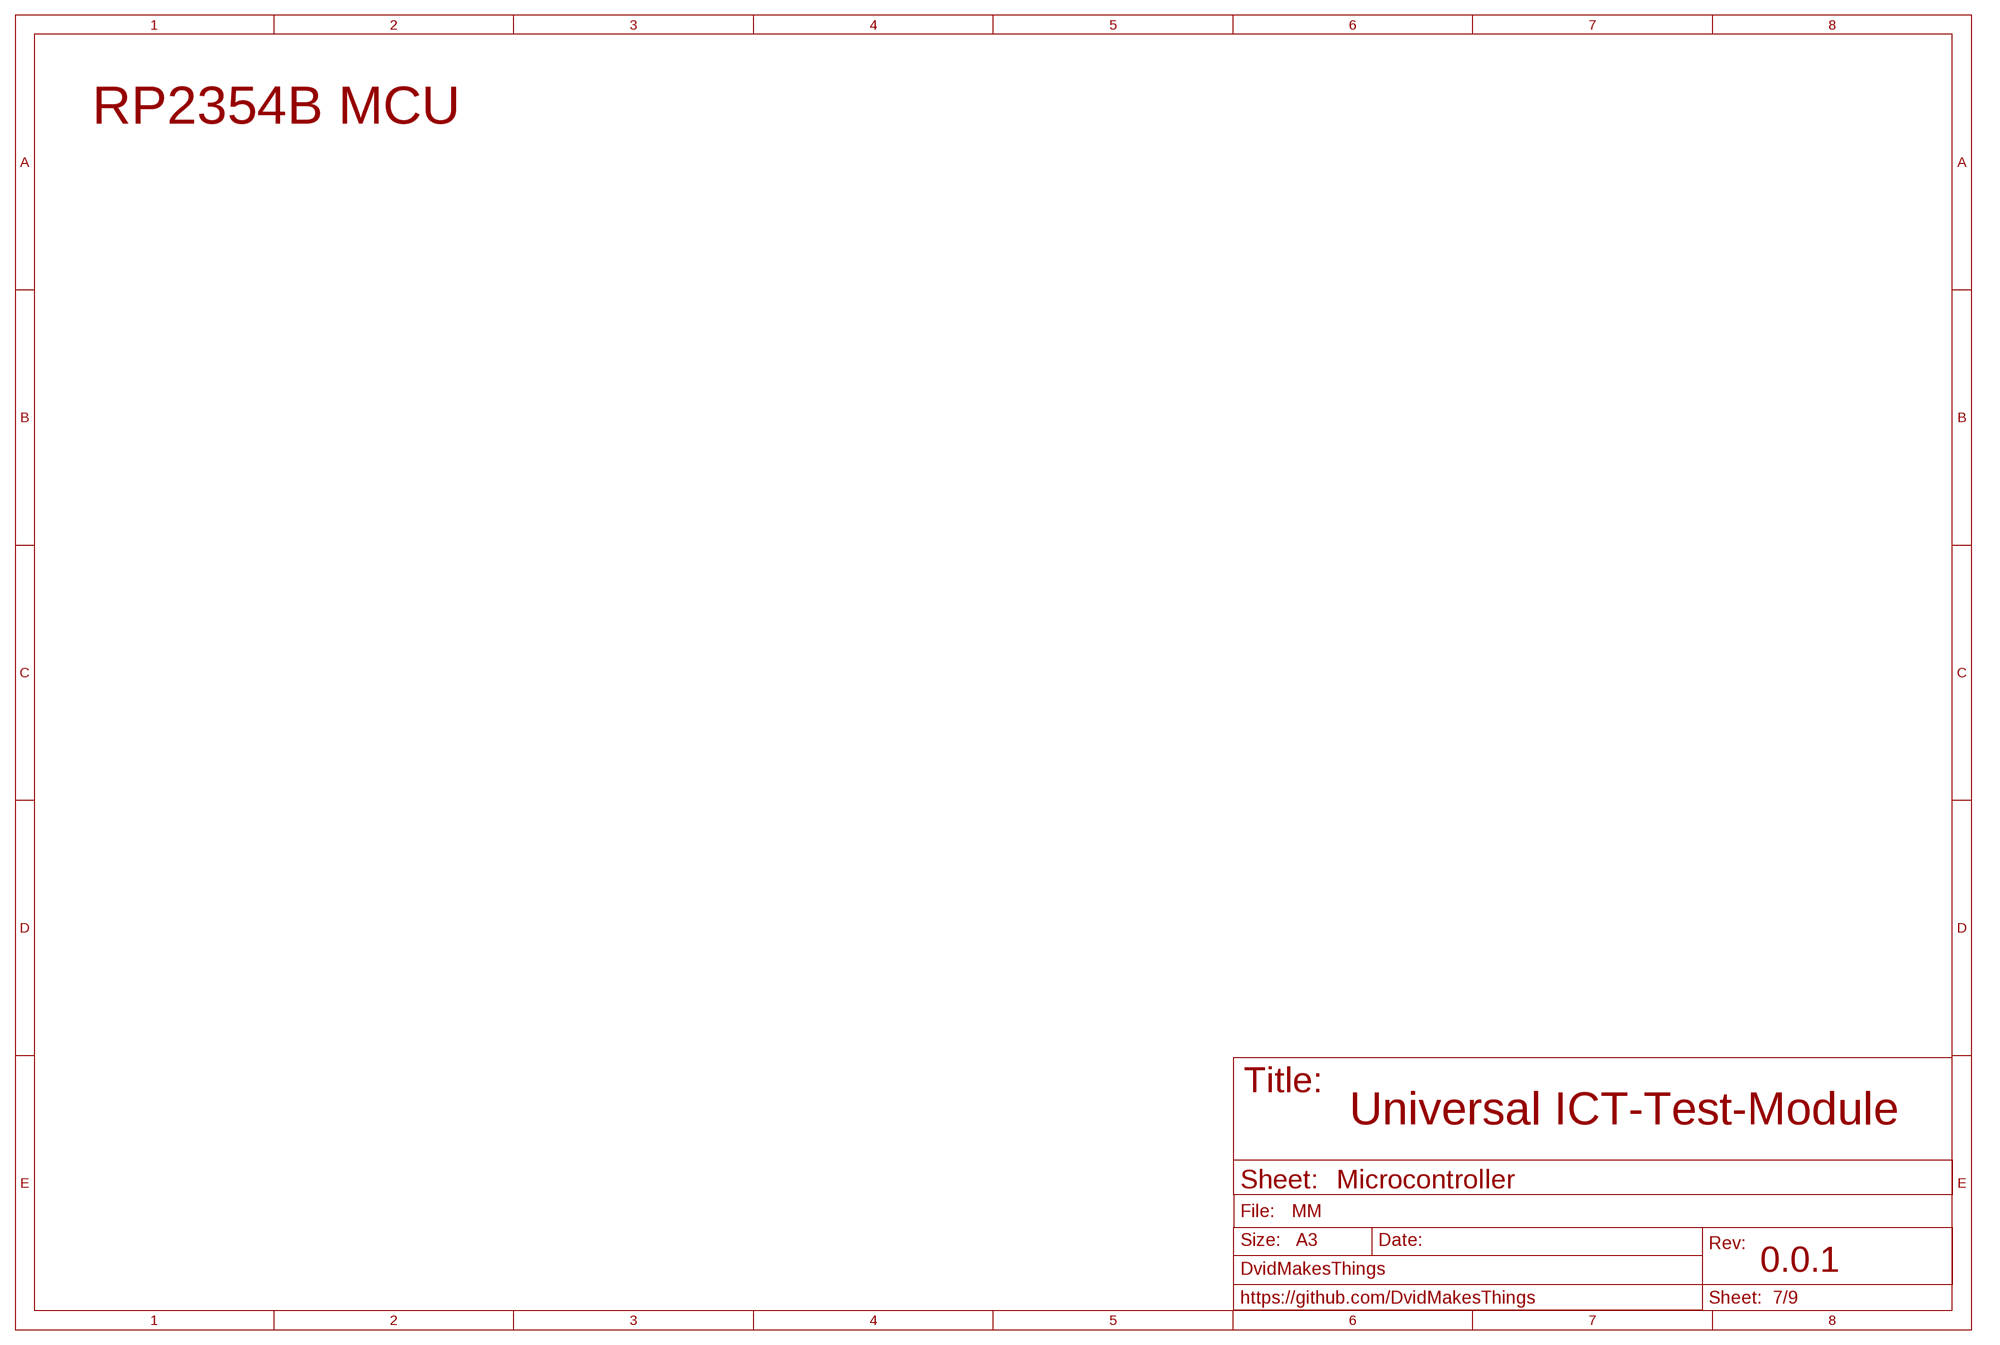
[diagram p6: schematic, sheet 7]

### Notes on the sheet
- RP2354B MCU
- Universal ICT-Test-Module
- Microcontroller

## Sheet 8 of 9
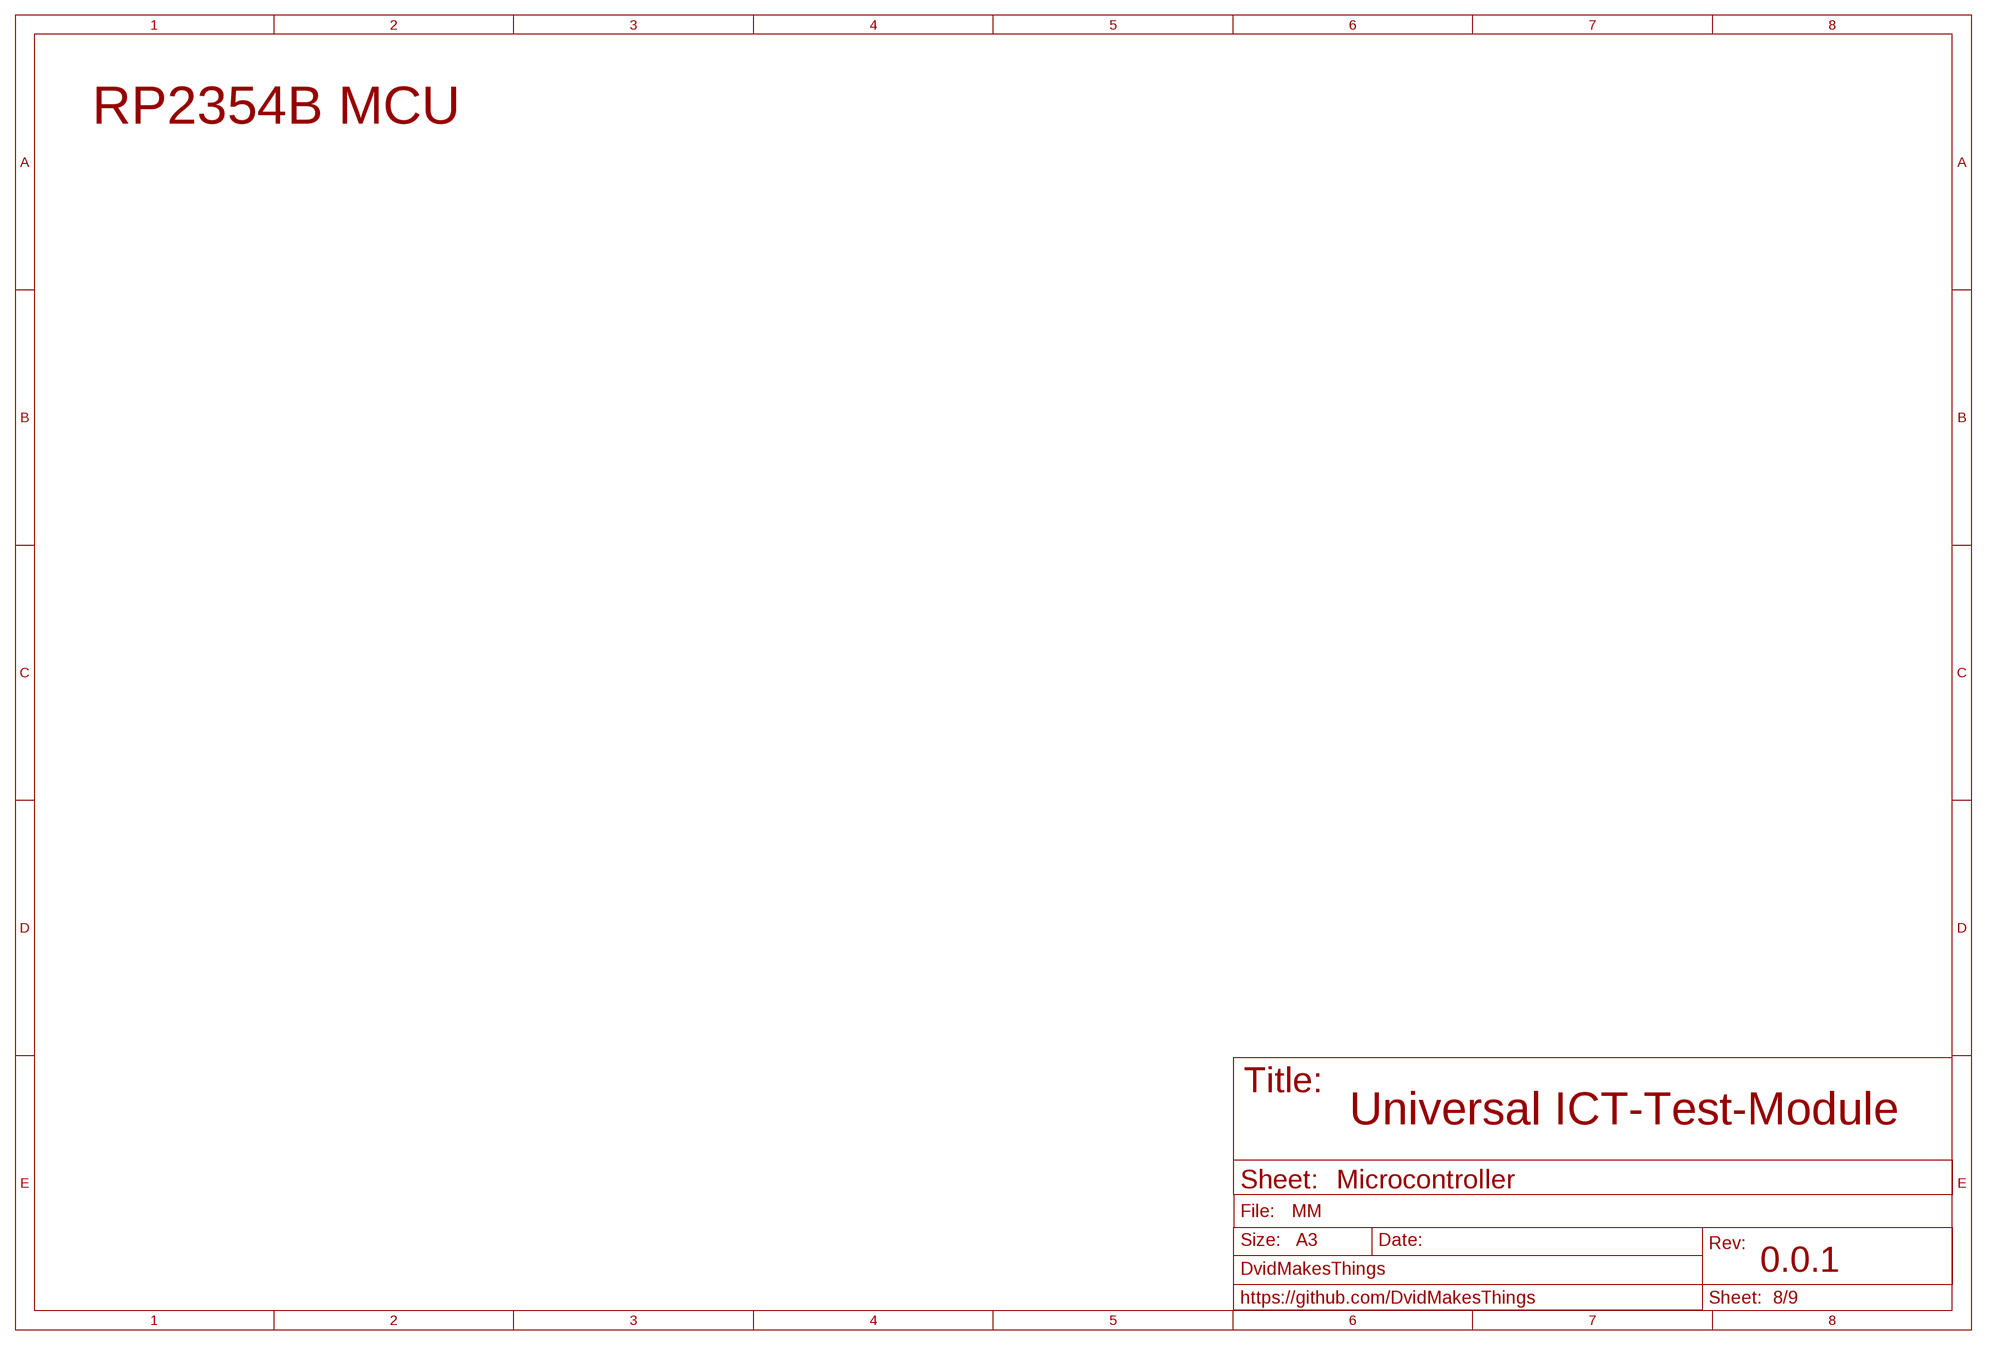
[diagram p7: schematic, sheet 8]

### Notes on the sheet
- RP2354B MCU
- Universal ICT-Test-Module
- Microcontroller

## Sheet 9 of 9: Board-To-Board
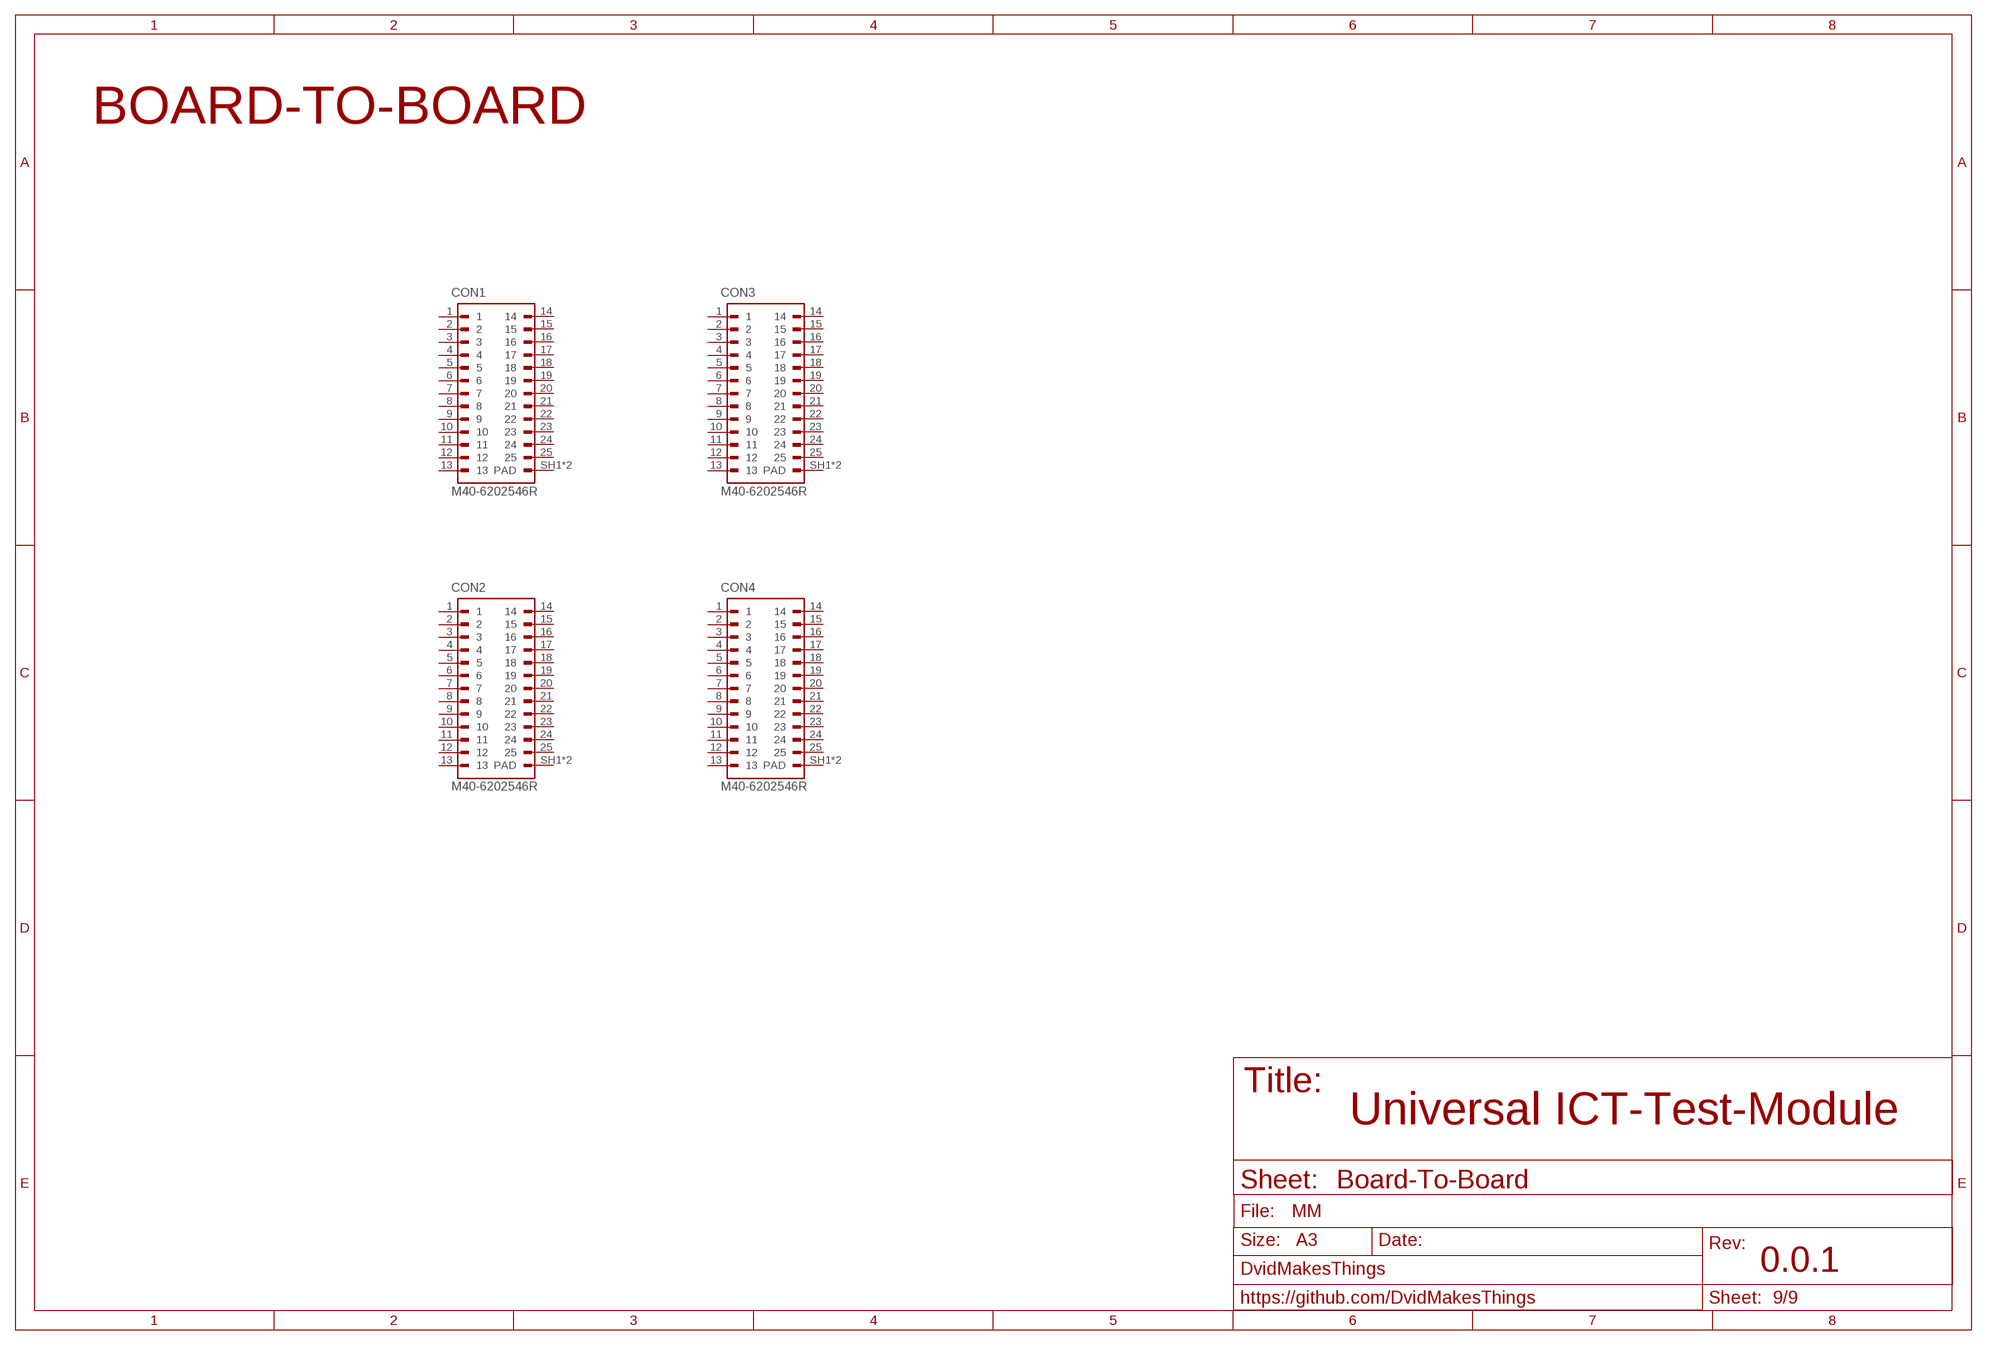
[diagram p8: schematic, sheet 9]

### Parts
CON1  M40-6202546R  M40-6002546RA  [M40-6202546]
CON2  M40-6202546R  M40-6002546RA  [M40-6202546]
CON3  M40-6202546R  M40-6002546RA  [M40-6202546]
CON4  M40-6202546R  M40-6002546RA  [M40-6202546]
Unconnected: CON1.1 CON1.2 CON1.3 CON1.4 CON1.5 CON1.6 CON1.7 CON1.8 CON1.9 CON1.10 CON1.11 CON1.12 CON1.13 CON1.14 CON1.15 CON1.16 CON1.17 CON1.18 CON1.19 CON1.20 CON1.21 CON1.22 CON1.23 CON1.24 CON1.25 CON1.SH1(PAD) CON1.SH2(PAD) CON2.1 CON2.2 CON2.3 CON2.4 CON2.5 CON2.6 CON2.7 CON2.8 CON2.9 CON2.10 CON2.11 CON2.12 CON2.13 CON2.14 CON2.15 CON2.16 CON2.17 CON2.18 CON2.19 CON2.20 CON2.21 CON2.22 CON2.23 CON2.24 CON2.25 CON2.SH1(PAD) CON2.SH2(PAD) CON3.1 CON3.2 CON3.3 CON3.4 CON3.5 CON3.6 CON3.7 CON3.8 CON3.9 CON3.10 CON3.11 CON3.12 CON3.13 CON3.14 CON3.15 CON3.16 CON3.17 CON3.18 CON3.19 CON3.20 CON3.21 CON3.22 CON3.23 CON3.24 CON3.25 CON3.SH1(PAD) CON3.SH2(PAD) CON4.1 CON4.2 CON4.3 CON4.4 CON4.5 CON4.6 CON4.7 CON4.8 CON4.9 CON4.10 CON4.11 CON4.12 CON4.13 CON4.14 CON4.15 CON4.16 CON4.17 CON4.18 CON4.19 CON4.20 CON4.21 CON4.22 CON4.23 CON4.24 CON4.25 CON4.SH1(PAD) CON4.SH2(PAD)

### Notes on the sheet
- BOARD-TO-BOARD
- Universal ICT-Test-Module
- Board-To-Board

## Library data of the parts
3VDC 3VFB 5VDC 5VFB GND GND-3 SW SW3 = ds_passive:TP; ROHS: YES
C1-C3 = ds_capacitors:4.7UF-25V; DESCRIPTION: 25V 4.7uF X5R ±20% 0402 Multilayer Ceramic Capacitors MLCC - SMD/SMT ROHS; HQ_PART: ZHLM0023346; LCSC_PART: C22367824; MANUFACTURER: Murata; MPN: GRM155R61E475ME15D; ROHS: YES
C4-C18 C50 C52-C55 C64 C89-C92 C94-C96 = ds_capacitors:100NF-25V; DESCRIPTION: 25V 100nF X5R ±10% 0201 Multilayer Ceramic Capacitors MLCC - SMD/SMT ROHS; HQ_PART: CA0183221; LCSC_PART: C76939; MANUFACTURER: Samsung; MPN: CL03A104MP3NNNC; ROHS: YES
C19-C21 C25 C29 C32 C38 C66-C68 C74-C76 = ds_capacitors:1UF-25V; DESCRIPTION: 25V 1uF X5R ±10% 0402 Multilayer Ceramic Capacitors MLCC - SMD/SMT ROHS; HQ_PART: CA0175588; LCSC_PART: C52923; MANUFACTURER: TDK; MPN: C1005X5R1E105KT000E; ROHS: YES
C22 C69 C77 = ds_capacitors:10UF-16V; DESCRIPTION: 16V 10uF X5R ±20% 0603 Multilayer Ceramic Capacitors MLCC - SMD/SMT ROHS; HQ_PART: CA0149236; LCSC_PART: C92487; MANUFACTURER: Murata; MPN: ZRB18AR61C106ME01L; ROHS: YES
C23 C27 C36 = ds_capacitors:22UF-25V; DESCRIPTION: 25V 22uF X5R ±20% 0805 Multilayer Ceramic Capacitors MLCC - SMD/SMT ROHS; HQ_PART: CA0182544; LCSC_PART: C45783; MANUFACTURER: Samsung; MPN: CL21A226MAYNNNE; ROHS: YES
C24 C26 C30 C31 C35 C39 C40 C43 C48 C56 C57 C60 C79 = ds_capacitors:100NF-25V; DESCRIPTION: 25V 100nF ±10% 0402 Multilayer Ceramic Capacitors MLCC - SMD/SMT ROHS; HQ_PART: CA0176807; LCSC_PART: C56392; MANUFACTURER: Walsin; MPN: 0402X104K250CT; ROHS: YES
C28 C37 = ds_capacitors:330UF-50V; DESCRIPTION: 330uF 50V ±20% SMD,D10xL10.2mm Aluminum Electrolytic Capacitors - SMD ROHS; LCSC_PART: C2895745; MPN: EEE-FT1H331AP; ROHS: YES
C33 C34 C41 C42 = ds_passive:C
C44 C61 = ds_capacitors:33PF-50V; DESCRIPTION: 50V 33pF NP0 ±5% 0402 Multilayer Ceramic Capacitors MLCC - SMD/SMT ROHS; HQ_PART: CA0484207; LCSC_PART: C107005; MANUFACTURER: PSA; MPN: FN15N330J500PNG; ROHS: YES
C45-C47 C62 C63 C65 = ds_capacitors:22UF-25V; DESCRIPTION: 25V 22uF X5R ±10% 1206 Multilayer Ceramic Capacitors MLCC - SMD/SMT ROHS; HQ_PART: CA0182777; LCSC_PART: C12891; MANUFACTURER: FH; MPN: 1206X226K250NT; ROHS: YES
C49 C51 C88 C93 = ds_capacitors:1UF-16V; DESCRIPTION: 16V 1uF X5R ±20% 0201 Multilayer Ceramic Capacitors MLCC - SMD/SMT ROHS; HQ_PART: CA0176810; LCSC_PART: C307385; MANUFACTURER: WALSIN; MPN: 0402X105K160CT; ROHS: YES
C58 C59 = ds_capacitors:15PF-50V; DESCRIPTION: 50V 15pF C0G ±5% 0201 Multilayer Ceramic Capacitors MLCC - SMD/SMT ROHS; HQ_PART: CA0136888; LCSC_PART: C22374851; MANUFACTURER: Yageo; MPN: CC0201JRNPO9BN150; ROHS: YES
C78 = ds_capacitors:4.7NF-50V; DESCRIPTION: 50V 4.7nF X7R ±10% 0402 Multilayer Ceramic Capacitors MLCC - SMD/SMT ROHS; HQ_PART: CA0176643; LCSC_PART: C1538; MANUFACTURER: Walsin; MPN: 0402B472K500CT; ROHS: YES
C80 = ds_capacitors:22NF-50V; DESCRIPTION: 50V 22nF X7R ±10% 0402 Multilayer Ceramic Capacitors MLCC - SMD/SMT ROHS; HQ_PART: CA0171190; LCSC_PART: C1532; MANUFACTURER: Samsung; MPN: CL05B223KB5NNNC; ROHS: YES
C83 = ds_capacitors:1NF-2KV; DESCRIPTION: Chip Capacitor (MLCC) 1206 1nF ±10% 2KV X7R; HQ_PART: CA0134884; MANUFACTURER: KEMET; MPN: C1206C102KGRACTU; ROHS: YES
C86 C87 = ds_capacitors:18PF-50V; DESCRIPTION: 50V 18pF C0G ±5% 0201 Multilayer Ceramic Capacitors MLCC - SMD/SMT ROHS; HQ_PART: CA0486739; LCSC_PART: C62164; MANUFACTURER: Yageo; MPN: CC0201GRNPO9BN180; ROHS: YES
CON1-CON4 = ds_con:M40-6002546R: 1.00mm Pitch DIL Vertical SMT Assembly; DESCRIPTION: 1.00mm Pitch DIL Vertical SMT Socket Assembly, location pegs, tin, 25 contacts, Tape & Reel packing
CON5 = ds_con:3220_10_0300_00: Connector Header Surface Mount 10 position 0.050" (1.27mm); DATASHEET: https://www.cnctech.us/pdfs/3220-XX-0300-00_.pdf; MANUFACTURER: CNC Tech; MPN: 3220-10-0300-00; ROHS: YES
D1 = ds_diode:SMBJ5929B; DATASHEET: https://ww1.microchip.com/downloads/aemDocuments/documents/HRDS/ProductDocuments/DataSheets/RF01101-SMB%28G%29%28J%295913-56.pdf; DESCRIPTION: 15V 1uA@11.4V 2W 9Ω SMBJ(DO-214AA) Zener Diodes; HQ_PART: DS2556081; LCSC_PART: C17530559; MPN: SMBJ5929B/TR13; ROHS: YES
D2 D3 D5 = ds_diode:1N4007: 1A Independent Type 1kV 1.1V@1A SMA(DO-214AC) Diodes - General Purpose ROHS; DATASHEET: https://www.sycelectronica.com.ar/semiconductores/1N4007-SMD.pdf?srsltid=AfmBOorCHiPwFTsNfQbBfqAoh5UjZ4nVNdjXugiEGIgvQSRi56Ew2-9Q; DESCRIPTION: 1A Independent Type 1kV 1.1V@1A SMA(DO-214AC) Diodes - General Purpose ROHS; HQ_PART: UN0002522; LCSC_PART: C727081; MANUFACTURER: SK; MPN: 1N4007G; ROHS: YES
DUT_1V0 DUT_1V2 DUT_3V3 DUT_5V0 = ds_LED:LED-BLUE; DESCRIPTION: 20mA 240mcd Colorless and transparent -20℃~+85℃ Positive Stick 455nm~475nm Blue 120° 70mW 3.3V 0603 LED Indication - Discrete ROHS; HQ_PART: PH0093698; LCSC_PART: C965807; MANUFACTURER: NATIONSTAR; MPN: FC-1608BK-465G5; ROHS: YES
ESD1 = ds_ic_peripherals:SP0503BAHT: TVS Diode Arrays Surface Mount TVS Avalanche Diode Array; DESCRIPTION: SOT-143 ESD and Surge Protection (TVS/ESD) ROHS; HQ_PART: CP0003989; LCSC_PART: C3040626; MANUFACTURER: Littelfuse; MPN: SP0503BAHTG; ROHS: YES
ETH1 = ds_con:J1B1211CCD: RJ45Receptacle 1 Shielded Bend insert cat5 Gold Phosphor Bronze WithLED -40℃~+85℃ Plugin Ethernet Connectors / Modular Connectors (RJ45 RJ11) ROHS; DATASHEET: file:///C:/Users/sdvid/Downloads/j1b1211ccd.pdf; DESCRIPTION: RJ45Receptacle 1 Shielded Bend insert cat5 Gold Phosphor Bronze WithLED -40℃~+85℃ Plugin Ethernet Connectors / Modular Connectors (RJ45 RJ11) ROHS; HQ_PART: UN0002907; LCSC_PART: C910371; MANUFACTURER: WIZnet; MPN: J1B1211CCD; ROHS: YES
IC1 = ds_ic_mcu:RP235XB: RP2350 is a new family of microcontrollers from Raspberry Pi that offers significant enhancements over RP2040. Key features include: • Dual Cortex-M33 or Hazard3 processors at 150 MHz • 520 kB on-chip SRAM, in 10 independent banks • 8 kB of one-time-programmable storage (OTP) • Up to 16 MB of external QSPI flash/PSRAM via dedicated QSPI bus ◦Additional 16 MB flash/PSRAM accessible via optional second chip-select • On-chip switched-mode power supply to generate core voltage ◦Low-quiescent-current LDO mode can be enabled for sleep states • 2× on-chip PLLs for internal or external clock generation • Security features: ◦Optional boot signing, enforced by on-chip mask ROM, with key fingerprint in OTP ◦Protected OTP storage for optional boot decryption key ◦Global bus filtering based on Arm or RISC-V security/privilege levels ◦Peripherals, GPIOs and DMA channels individually assignable to security domains ◦Hardware mitigations for fault injection attacks ◦Hardware SHA-256 accelerator • Peripherals: ◦2× UARTs ◦2× SPI controllers ◦2× I2C controllers ◦24× PWM channels ◦USB 1.1 controller and PHY, with host and device support ◦12× PIO state machines ◦1× HSTX peripheral
IC2 IC8 IC10 = ds_ic_vreg:TPS74801DRC; DESCRIPTION: Low-Dropout Linear Regulator With Programmable Soft-Start; MANUFACTURER: Texas Instruments; MPN: TPS74801DRCR; ROHS: YES; VIN: 0.8V to 5.5V; VOUT: 0.8V to 3.6V
IC3 = ds_ic_peripherals:CYPD3177: USB Type-C Port Controller for Power Sinks
IC4 IC13 = ds_ic_peripherals:INA219: 26-V 12-bit I2C output digital power monitor; DATASHEET: https://www.ti.com/lit/ds/symlink/ina219.pdf?ts=1746203207020&ref_url=https%253A%252F%252Fwww.ti.com%252Fproduct%252FINA219%253Futm_source%253Dgoogle%2526utm_medium%253Dcpc%2526utm_campaign%253Dasc-amps-null-44700045336317113_prodfolderdynamic-cpc-pf-google-ww_en_int%2526utm_content%253Dprodfolddynamic%2526ds_k%253DDYNAMIC+SEARCH+ADS%2526DCM%253Dyes%2526gad_source%253D1%2526gad_campaignid%253D6465287935%2526gbraid%253D0AAAAAC068F29A-VFUfql4RGIMSgS5JF2z%2526gclid%253DCj0KCQjw2tHABhCiARIsANZzDWoEXFkzyL_LeVAGcFnL_-XGNWpvMIarUVX6O9OTsjwf9O46oUFWObgaAqp2EALw_wcB%2526gclsrc%253Daw.ds; HQ_PART: IC0063216; LCSC_PART: C2653868; MANUFACTURER: Texas Instruments; MPN: INA219BIDCNT; ROHS: YES
IC5 IC7 = ds_ic_vreg:MP2315: Description The MP2315 is a high frequency synchronous rectified step-down switch mode converter with built in internal power MOSFETs. It offers a very compact solution to achieve 3A continuous output current over a wide input supply range with excellent load and line regulation. The MP2315 has synchronous mode operation for higher efficiency over output current load range. Current mode operation provides fast transient response and eases loop stabilization. Full protection features include OCP and thermal shut down.; DATASHEET: https://www.monolithicpower.com/en/documentview/productdocument/index/version/2/document_type/Datasheet/lang/EN/sku/MP2315S?srsltid=AfmBOoqbTpEIx6KSoiWl4ZUQnKkVQGj573Ur79inB-ZmXjzR-CZxOYOr; DESCRIPTION: Step-down type Adjustable 800mV~22.8V 3A 4.5V~24V TSOT-23-8 DC-DC Converters ROHS; HQ_PART: IC0339027; LCSC_PART: C45889; MANUFACTURER: MPS; MPN: MP2315GJ-Z; ROHS: YES
IC6 = ds_ic_peripherals:W6300: W6300 is a WIZnet 10/100 TOE ethernet chip that combines the high-speed ethernet performance with Dual IPv4/v6 Hardware stack. To support ethernet performance up to 90Mbps and above, it supports 150MHz system clock and QSPI interface(including 4 Data lines). W6300 supports a total SRAM size of 64KB for 8 sockets, each has 4KB TX/RX buffer by default.; DATASHEET: https://docs.wiznet.io/assets/files/W6300%20DS_V100E-b7faabfc62400edb7ae942f77c424dca.pdf; MANUFACTURER: WIZnet; MPN: W6300; ROHS: YES
IC18 = ds_ic_memory:W25Q128JV: 3V 128M-BIT SERIAL FLASH MEMORY WITH DUAL/QUAD SPI & QPI & DTR; DATASHEET: https://www.nikom.biz/pdf/A089014.pdf?srsltid=AfmBOopZgx1G_qpdWEIfoO5Ne0YuvaGR9ub92ZA1x90R1kz9P6rrUXmf; DESCRIPTION: 128Mbit WSON-8-EP(5x6) NOR FLASH ROHS; HQ_PART: IC0150933; LCSC_PART: C190862; MANUFACTURER: Winbond; MPN: W25Q128JVPIQ; ROHS: YES
L1 = ds_inductor:3.3UH; DESCRIPTION: 3.7A 3.3uH ±20% 31.2mΩ SMD,5.8x5.2mm Inductors (SMD) ROHS; LCSC_PART: C2929428; VALUE: 3.3uH
L2 L6 = ds_inductor:4.7UH; DESCRIPTION: Power Inductance 70mΩ 4.7µH ±20% 2.5A - IND_5.8X5.2MM_SM; HQ_PART: IN0027228; MANUFACTURER: YJYCOIN; MPN: YP0503-4R7M; ROHS: YES
L3-L5 = ds_inductor:BLM18PG121SH1D: 150mΩ ±25% 220Ω@100MHz 0603 Ferrite Beads ROHS; DESCRIPTION: -55℃~+125℃ 1 120Ω@100MHz 2A 50mΩ ±25% 0603 Ferrite Beads ROHS; HQ_PART: WF0012207; LCSC_PART: C354394; MANUFACTURER: Murata; MPN: BLM18PG121SH1D; ROHS: YES
P3ON1 P5ON = ds_LED:LED-GREEN; DESCRIPTION: 20mA 810mcd Colorless and transparent Individual diode 515nm~535nm -20℃~+85℃ Positive Stick Emerald 120° 70mW 3.3V 0603 LED Indication - Discrete ROHS; HQ_PART: PH0010430; LCSC_PART: C965804; MANUFACTURER: Wurth; MPN: 150060GS75000; ROHS: YES
R1 = ds_resistor:33R-1%; DESCRIPTION: -55℃~+155℃ 125mW 150V 33Ω Thick Film Resistor ±1% ±200ppm/℃ 0805 Chip Resistor - Surface Mount ROHS; HQ_PART: RE0322562; LCSC_PART: C17634; MANUFACTURER: RALEC; MPN: RTT0533R0FTP; PACKAGE: 0805; ROHS: YES
R2 R47 R57 = ds_resistor:4.7K-1%; DESCRIPTION: 62.5mW Thick Film Resistors 50V ±100ppm/℃ ±1% 4.7kΩ 0402 Chip Resistor - Surface Mount ROHS; LCSC_PART: C25900
R3 R48 R58 = ds_resistor:1.5K-1%; DESCRIPTION: 62.5mW Thick Film Resistors 50V ±100ppm/℃ ±1% 1.5kΩ 0402 Chip Resistor - Surface Mount ROHS; HQ_PART: RE0010050; LCSC_PART: C25867; MANUFACTURER: Yageo; MPN: RC0402FR-071K5L; ROHS: YES
R4-R6 R9 R44 R49 R50 R59 R60 R132 R162 = ds_resistor:10K-1%; DESCRIPTION: 62.5mW Thick Film Resistors 50V ±100ppm/℃ ±1% 10kΩ 0402 Chip Resistor - Surface Mount ROHS; HQ_PART: RE0207399; LCSC_PART: C25744; MANUFACTURER: ROHM; MPN: MCR01MZPF1002; ROHS: YES
R7 R22 = ds_resistor:49.9K-1%; DESCRIPTION: -55℃~+155℃ 125mW 150V 49.9kΩ Thick Film Resistor ±1% ±100ppm/℃ 0805 Chip Resistor - Surface Mount ROHS; HQ_PART: RE0204392; LCSC_PART: C17719; MANUFACTURER: Yageo; MIN_AMMOUNT: 1; MPN: AC0805FR-0749K9L; PACKAGE: 0805; ROHS: YES
R8 R20 R112 R123 = ds_resistor:1K-1%; DESCRIPTION: 62.5mW Thick Film Resistors 50V ±100ppm/℃ ±1% 1kΩ 0402 Chip Resistor - Surface Mount ROHS; HQ_PART: RE0208724; LCSC_PART: C11702; MANUFACTURER: FH; MPN: RC-02K1001FT; ROHS: YES
R10-R12 R19 = ds_resistor:5.1K-1%; DESCRIPTION: 62.5mW Thick Film Resistors 50V ±100ppm/℃ ±1% 5.1kΩ 0402 Chip Resistor - Surface Mount ROHS; LCSC_PART: C25905
R13 R35 = ds_resistor:0R; DESCRIPTION: 62.5mW Thick Film Resistors 50V ±800ppm/℃ ±1% 0Ω 0402 Chip Resistor - Surface Mount ROHS; HQ_PART: RE0250181; LCSC_PART: C17168; MANUFACTURER: YAGEO; MPN: RC0402JR-130RL; ROHS: YES
R14 R18 R148 = ds_resistor:2.4K-1%; DESCRIPTION: 62.5mW Thick Film Resistors 50V ±100ppm/℃ ±1% 2.4kΩ 0402 Chip Resistor - Surface Mount ROHS; HQ_PART: RE0202491; LCSC_PART: C25882; MANUFACTURER: LIZ; MPN: CR0402FF2401G; ROHS: YES
R15 R160 = ds_resistor:27R-1%; DESCRIPTION: 50mW Thick Film Resistors 25V ±1% ±200ppm/℃ 27Ω 0201 Chip Resistor - Surface Mount ROHS; HQ_PART: RE0209327; LCSC_PART: C473051; MANUFACTURER: FH; MPN: RC-01W27R0FT; ROHS: YES
R16 = ds_resistor:1K-1%; DESCRIPTION: 50mW Thick Film Resistors 25V ±1% ±200ppm/℃ 1kΩ 0201 Chip Resistor - Surface Mount ROHS; HQ_PART: RE0015967; LCSC_PART: C270365; MANUFACTURER: Yageo; MPN: RC0201FR-071KL; ROHS: YES
R17 = ds_resistor:0.012R-1%; DESCRIPTION: -65℃~+170℃ 12mΩ 5W ±1% ±50ppm/℃ 2512 Chip Resistor - Surface Mount ROHS; MANUFACTURER: Isabellenhuette USA; MPN: SMS-R012-1.0; PACKAGE: 2512; ROHS: YES
R21 R30 R36 R43 R111 R161 = ds_passive:R
R23 = ds_resistor:0.050R-1%; DESCRIPTION: -65℃~+170℃ 50mΩ 5W ±1% ±50ppm/℃ 2512 Chip Resistor - Surface Mount ROHS; LCSC_PART: C6680752; MANUFACTURER: Isabellenhuette USA; MPN: SMS-R050-1.0; PACKAGE: 2512; ROHS: YES
R24 = ds_resistor:9.09K-1%; DESCRIPTION: 62.5mW Thick Film Resistors 50V ±100ppm/℃ ±1% 9.09kΩ 0402 Chip Resistor - Surface Mount ROHS; HQ_PART: RE0203888; LCSC_PART: C11549; MANUFACTURER: Yageo; MPN: AC0402FR-079K09L; ROHS: YES
R25 R38 = ds_resistor:10R-1%; DESCRIPTION: 62.5mW Thick Film Resistors 50V ±1% ±200ppm/℃ 10Ω 0402 Chip Resistor - Surface Mount ROHS; HQ_PART: RE0191560; LCSC_PART: C25077; MANUFACTURER: Uniohm; MPN: 0402WGF100JTCE; ROHS: YES
R26 = ds_resistor:20K-1%; DESCRIPTION: 62.5mW Thick Film Resistors 50V ±100ppm/℃ ±1% 20kΩ 0402 Chip Resistor - Surface Mount ROHS; HQ_PART: RE0203337; LCSC_PART: C25765; MANUFACTURER: FH; MPN: RC-02W2002FT; ROHS: YES
R27 R40 = ds_resistor:40.2K-1%; DESCRIPTION: 62.5mW Thick Film Resistors 50V ±100ppm/℃ ±1% 40.2kΩ 0402 Chip Resistor - Surface Mount ROHS; HQ_PART: RE0063264; LCSC_PART: C25893; MANUFACTURER: Yageo; MPN: AC0402FR-0740K2L; ROHS: YES
R28 R37 = ds_resistor:7.5K-1%; DESCRIPTION: 62.5mW Thick Film Resistors 50V ±100ppm/℃ ±1% 7.5kΩ 0402 Chip Resistor - Surface Mount ROHS; HQ_PART: RE0188271; LCSC_PART: C25918; MANUFACTURER: Uniohm; MPN: 0402WGF7501TCE; ROHS: YES
R29 R42 R126 = ds_resistor:100K-1%; DESCRIPTION: 62.5mW Thick Film Resistors 50V ±100ppm/℃ ±1% 100kΩ 0402 Chip Resistor - Surface Mount ROHS; HQ_PART: RE0203322; LCSC_PART: C25741; MANUFACTURER: FH; MPN: RC-02W1003FT; ROHS: YES
R31 R32 R45 R46 R127 = ds_resistor:10K-1%; DESCRIPTION: 50mW Thick Film Resistors 25V ±1% ±200ppm/℃ 10kΩ 0201 Chip Resistor - Surface Mount ROHS; HQ_PART: RE0208620; LCSC_PART: C473048; MANUFACTURER: FH; MPN: RC-01W1002FT; ROHS: YES
R34 = ds_resistor:12.4K-1%; DESCRIPTION: 63mW Thin Film Resistor 50V ±0.1% ±25ppm/℃ 12.4kΩ 0402 Chip Resistor - Surface Mount ROHS; LCSC_PART: C490814
R39 = ds_resistor:33K-1%; DESCRIPTION: 62.5mW Thick Film Resistors 50V ±100ppm/℃ ±1% 33kΩ 0402 Chip Resistor - Surface Mount ROHS; HQ_PART: RE0321838; LCSC_PART: C25779; MANUFACTURER: RALEC; MPN: RTT023302FTH; ROHS: YES
R41 = ds_resistor:12.7K-1%; DESCRIPTION: 62.5mW Thick Film Resistors 50V ±100ppm/℃ ±1% 12.7kΩ 0402 Chip Resistor - Surface Mount ROHS; HQ_PART: RE0202294; LCSC_PART: C25853; MANUFACTURER: Yageo; MPN: AC0402FR-0712K7L; ROHS: YES
R110 = ds_resistor:1M-1%; DESCRIPTION: 250mW Thick Film Resistors 200V ±100ppm/℃ ±1% 1MΩ 1206 Chip Resistor - Surface Mount ROHS; HQ_PART: RE0188103; LCSC_PART: C17927; MANUFACTURER: Uniohm; MPN: 1206W4F1004T5E; ROHS: YES
R121 = ds_resistor:2.2K-1%; DESCRIPTION: 50mW Thick Film Resistors 25V ±1% ±200ppm/℃ 2.2kΩ 0201 Chip Resistor - Surface Mount ROHS; HQ_PART: RE0209901; LCSC_PART: C473508; MANUFACTURER: FH; MPN: RC-01W2201FT; ROHS: YES
R124 R125 = ds_resistor:5.1K-1%; DESCRIPTION: 50mW Thick Film Resistors 25V ±1% ±200ppm/℃ 5.1kΩ 0201 Chip Resistor - Surface Mount ROHS; HQ_PART: RE0185972; LCSC_PART: C274341; MANUFACTURER: Yageo; MPN: RC0201FR-075K1L; ROHS: YES
R131 = ds_resistor:1M-1%; DESCRIPTION: 62.5mW Thick Film Resistors 50V ±100ppm/℃ ±1% 1MΩ 0402 Chip Resistor - Surface Mount ROHS; HQ_PART: RE0055809; LCSC_PART: C26083; MANUFACTURER: Vishay; MPN: MCS04020C1004FE000; ROHS: YES
R133-R136 = ds_resistor:3.3R-1%; DESCRIPTION: 50mW Thick Film Resistors 25V -200ppm/℃~+400ppm/℃ ±1% 3.3Ω 0201 Chip Resistor - Surface Mount ROHS; HQ_PART: RE0422979; LCSC_PART: C158547; MANUFACTURER: Uniohm; MPN: 0201WMF330KTEE; ROHS: YES
R137-R140 = ds_resistor:49.9R-1%; DESCRIPTION: 50mW Thick Film Resistors 25V ±1% ±200ppm/℃ 49.9Ω 0201 Chip Resistor - Surface Mount ROHS; HQ_PART: RE0721921; LCSC_PART: C155744; MANUFACTURER: FH; MPN: RC-01W49R9FTE; ROHS: YES
R141 R142 = ds_resistor:470R-1%; DESCRIPTION: 62.5mW Thick Film Resistors 50V ±100ppm/℃ ±1% 470Ω 0402 Chip Resistor - Surface Mount ROHS; HQ_PART: RE0205922; LCSC_PART: C25117; MANUFACTURER: Panasonic; MPN: ERJ2RKF4700X; ROHS: YES
R144 = ds_resistor:1M-1%; DESCRIPTION: 50mW Thick Film Resistors 25V ±1% ±200ppm/℃ 1MΩ 0201 Chip Resistor - Surface Mount ROHS; HQ_PART: RE0422946; LCSC_PART: C295786; MANUFACTURER: Yageo; MPN: AC0201FR-071ML; ROHS: YES
R145 = ds_resistor:4.7K-1%; DESCRIPTION: 50mW Thick Film Resistors 25V ±1% ±200ppm/℃ 4.7kΩ 0201 Chip Resistor - Surface Mount ROHS; HQ_PART: RE0208670; LCSC_PART: C270346; MANUFACTURER: RALEC; MPN: RTT014701FTH; ROHS: YES
RESET = ds_passive:B3U-1000P: 2.5mm 1.6mm Round Button 50mA Standing paste 3mm SPST 153gf 12V SMD,2.5x3mm Tactile Switches ROHS; DATASHEET: https://omronfs.omron.com/en_US/ecb/products/pdf/en-b3u.pdf; DESCRIPTION: 2.5mm 1.6mm Round Button 50mA Standing paste 3mm SPST 153gf 12V SMD,2.5x3mm Tactile Switches ROHS; HQ_PART: SW0036094; LCSC_PART: C231329; MANUFACTURER: Omron; MPN: B3U-1000P; ROHS: YES
RN1 = ds_resistor:1K-1%_ARRAY; DESCRIPTION: 4 ±1% 1kΩ 62.5mW ±200ppm/℃ 0603x4 Resistor Networks, Arrays ROHS; HQ_PART: RE0022532; LCSC_PART: C110021; MANUFACTURER: Yageo; MPN: YC164-JR-071KL; ROHS: YES
T1-T4 = ds_active:DMP3013SFV-7; DATASHEET: https://www.diodes.com/assets/Datasheets/DMP3013SFV.pdf; MANUFACTURER_PART_NUMBER: DMP3013SFV-7; MFR_NAME: Diodes Inc
USB1 = ds_con:USB_C; DESCRIPTION: 3A 1 Horizontal attachment 16P Female -25℃~+85℃ Type-C SMD USB Connectors ROHS; HQ_PART: ZHLM0322915; LCSC_PART: C2927038; MANUFACTURER: DEALON; MPN: USB-TYPE-C-018; ROHS: YES
X1 = ds_passive:CRYSTAL-3225; DESCRIPTION: 12MHz Surface Mount Crystal 20pF ±10ppm ±20ppm SMD3225-4P Crystals ROHS; HQ_PART: CR0250194; LCSC_PART: C20625731; MANUFACTURER: TKD; MPN: SX32Y012000B91T; ROHS: YES
X2 = ds_passive:CRYSTAL-3225; DESCRIPTION: 25MHz Surface Mount Crystal 12pF ±10ppm ±20ppm SMD3225-4P Crystals ROHS; HQ_PART: CR0250343; LCSC_PART: C9006; MANUFACTURER: Epson; MPN: X1E000021013900; ROHS: YES

## Net classes
1 100R_DIFFPAIR: width 0.118 mm, drill 0.2 mm, clearance 0.19 mm
2 90R_DIFFPAIR: width 0.149 mm, drill 0.2 mm, clearance 0.178 mm